# EAGLE board 20150104_QSE_to_FMC_6Layer_R3.1 (EAGLE 7.2.0), part 1 of 6
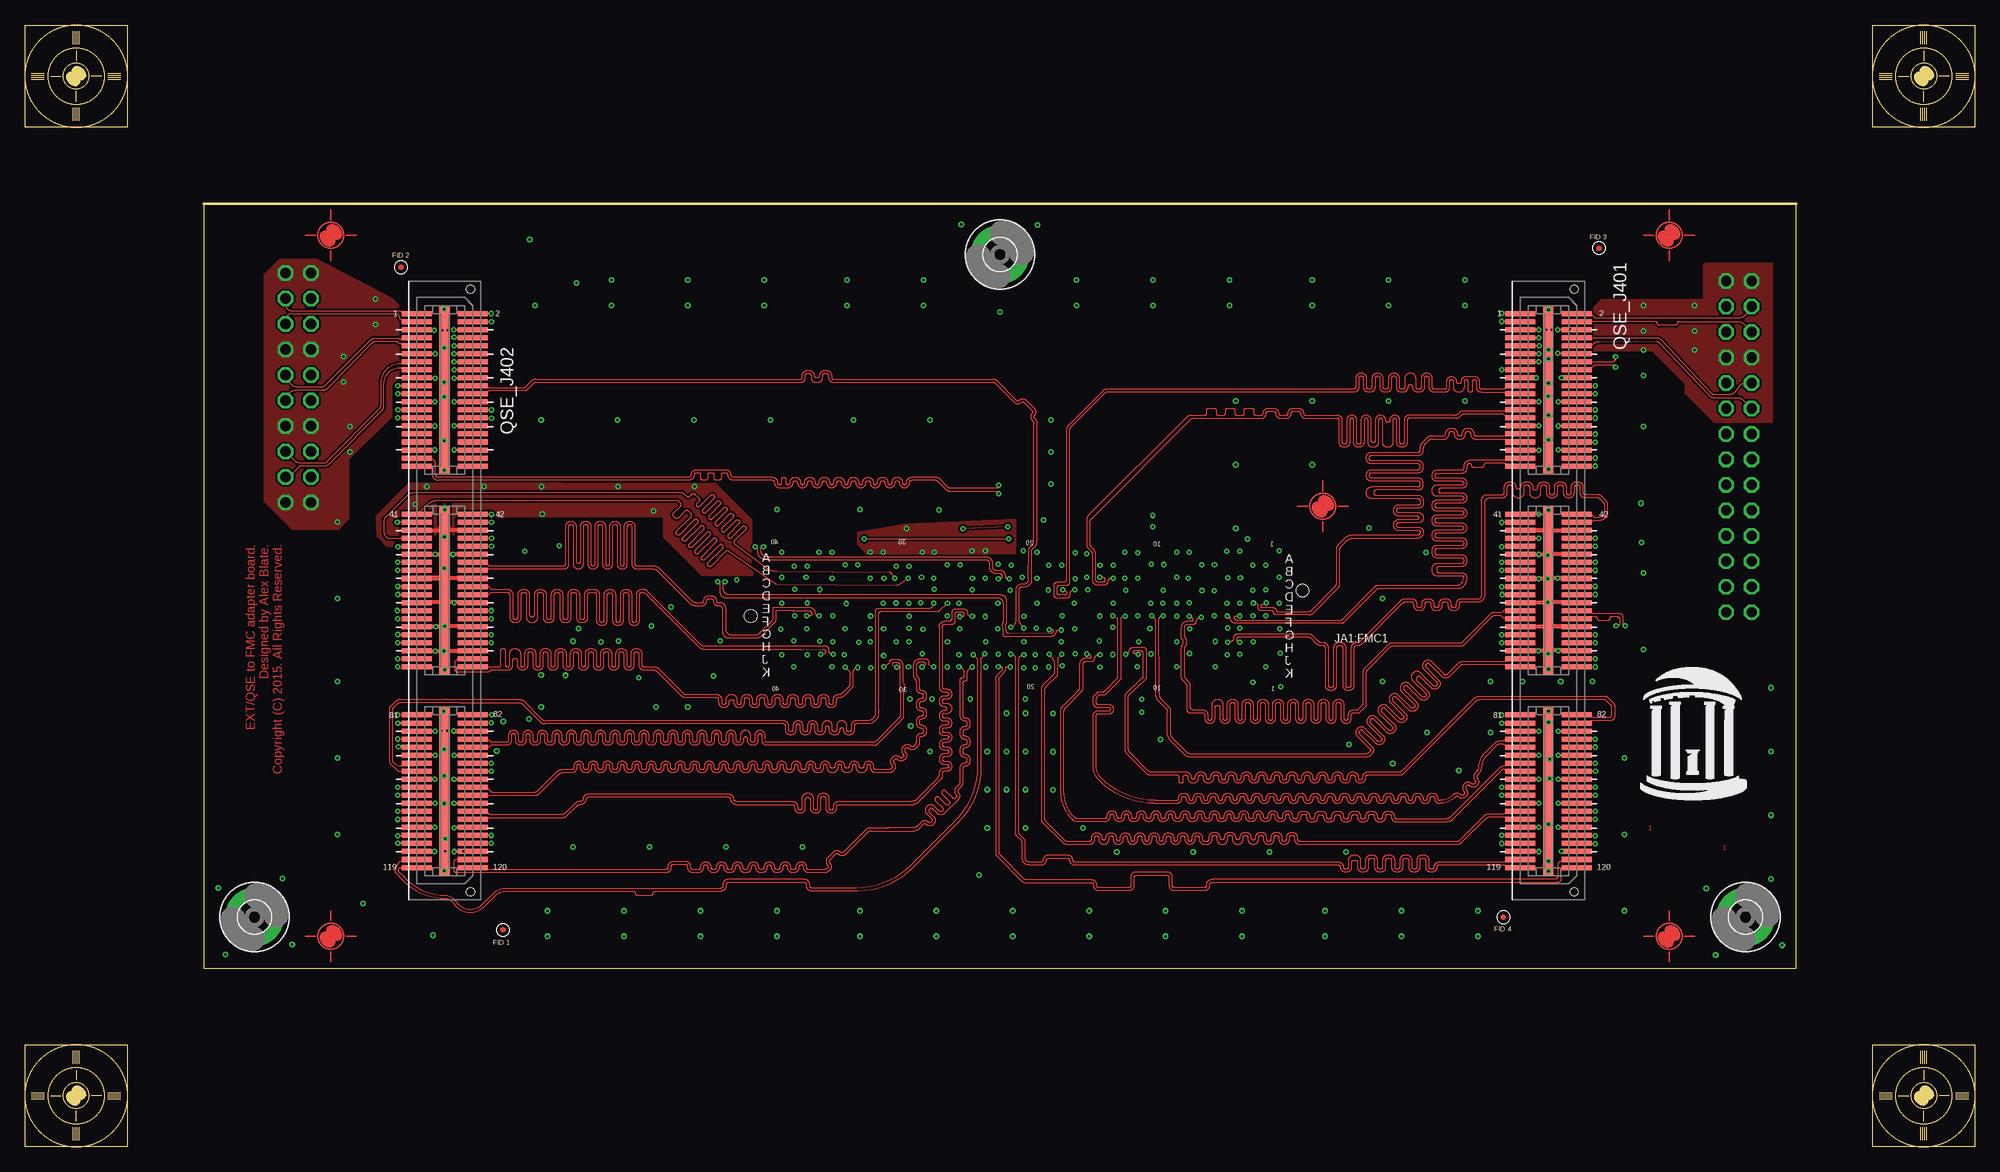
[diagram p6: board, top side]
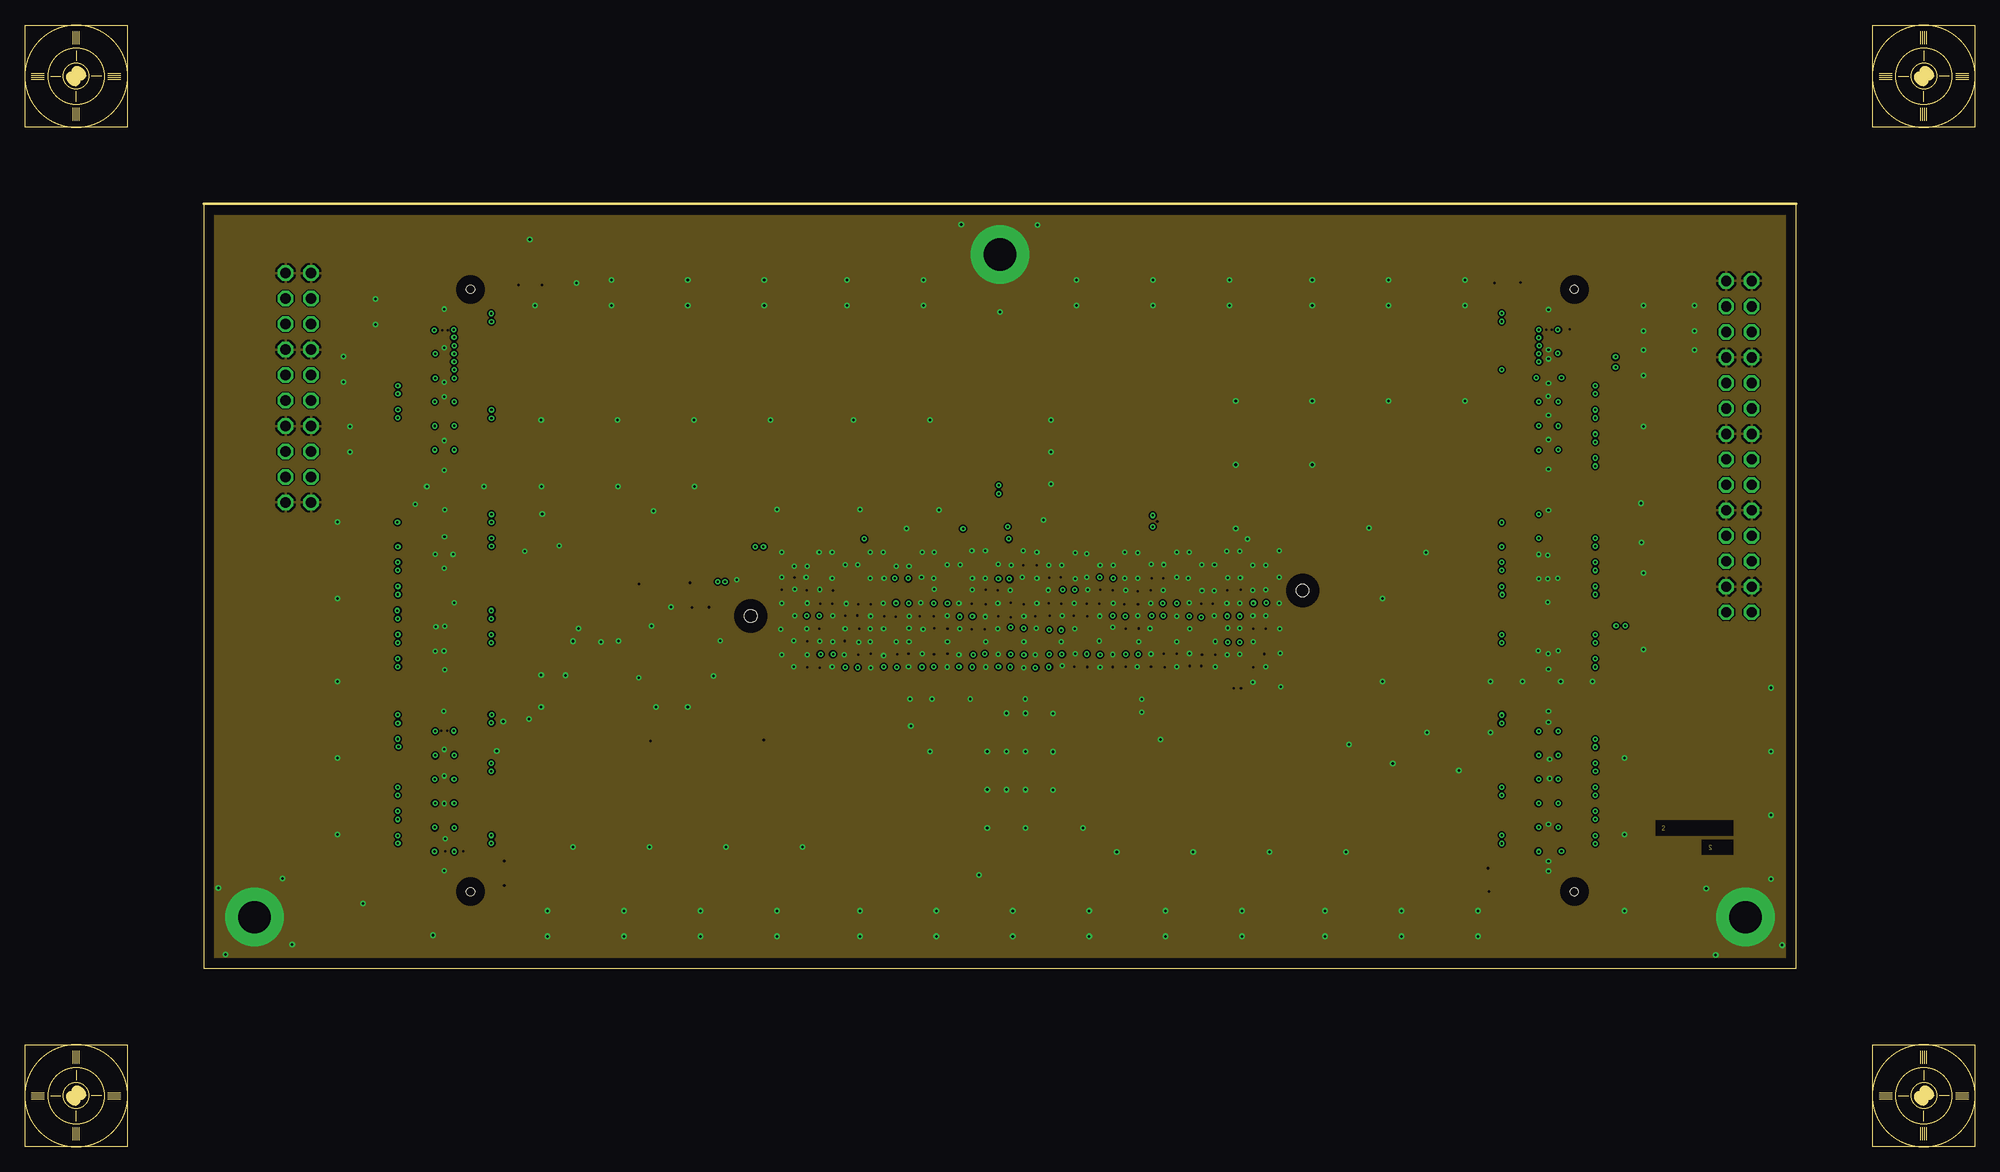
[diagram p7: board, inner layer GND_2]
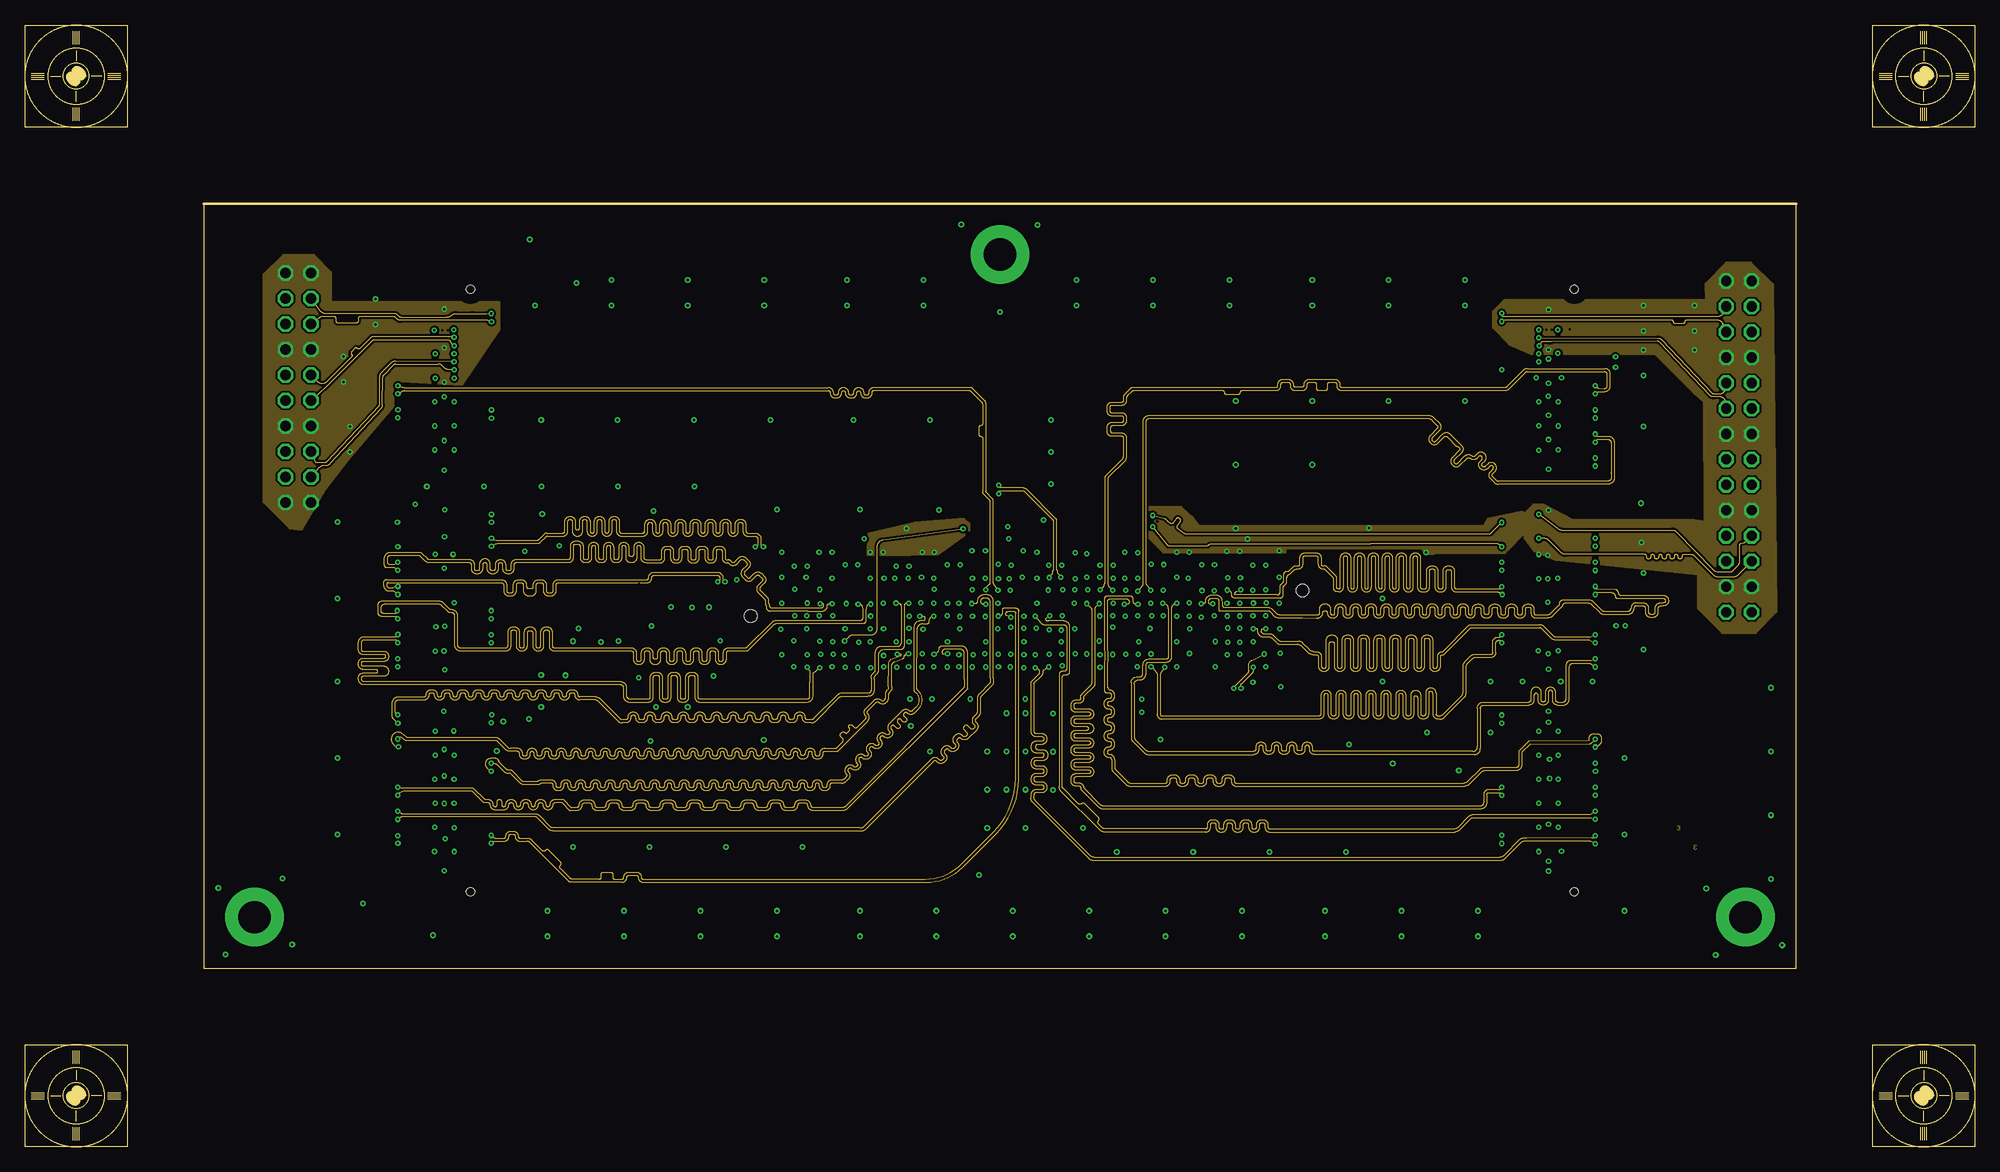
[diagram p8: board, inner layer 3_SIG2]
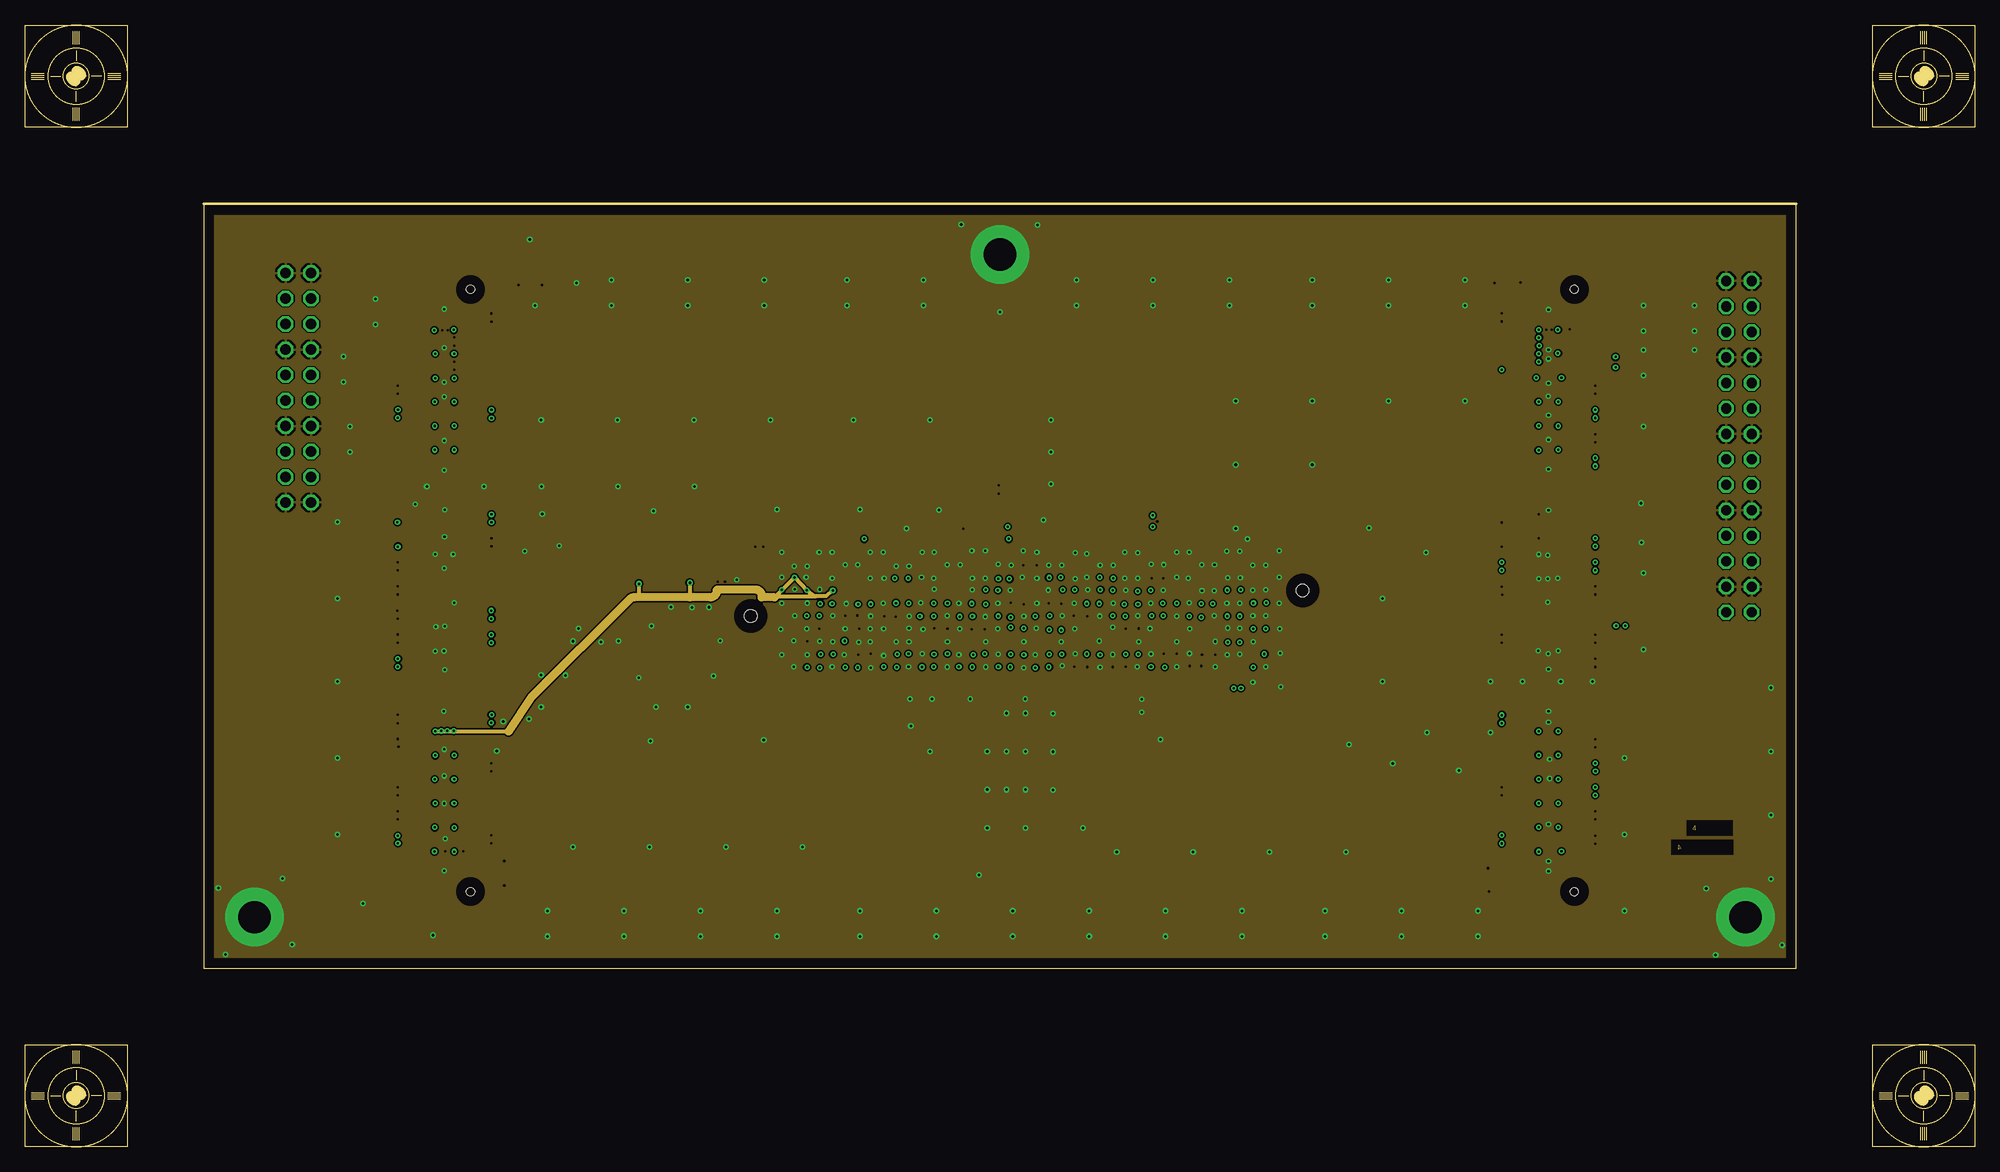
[diagram p9: board, inner layer GND_4]
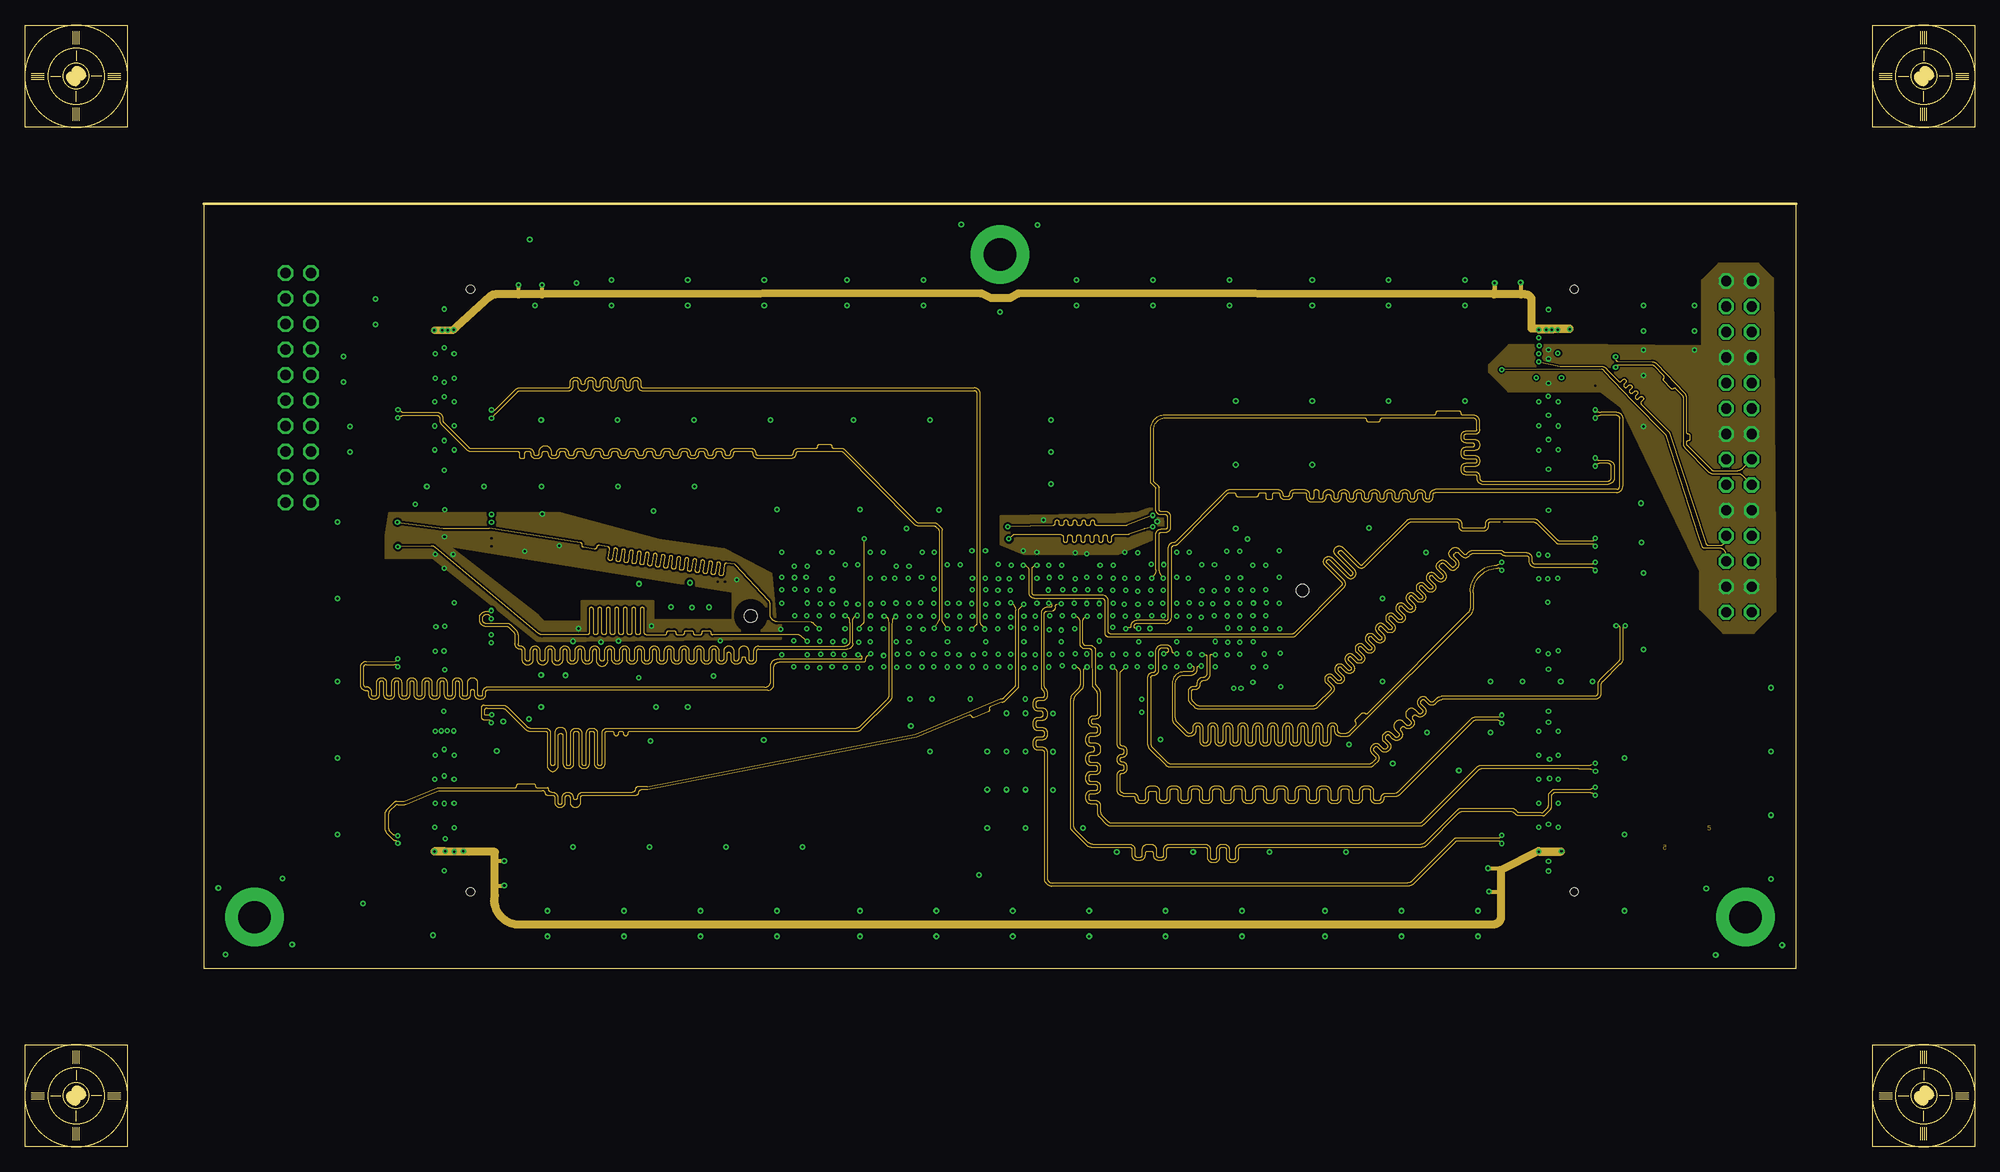
[diagram p10: board, inner layer 5_SIG3]
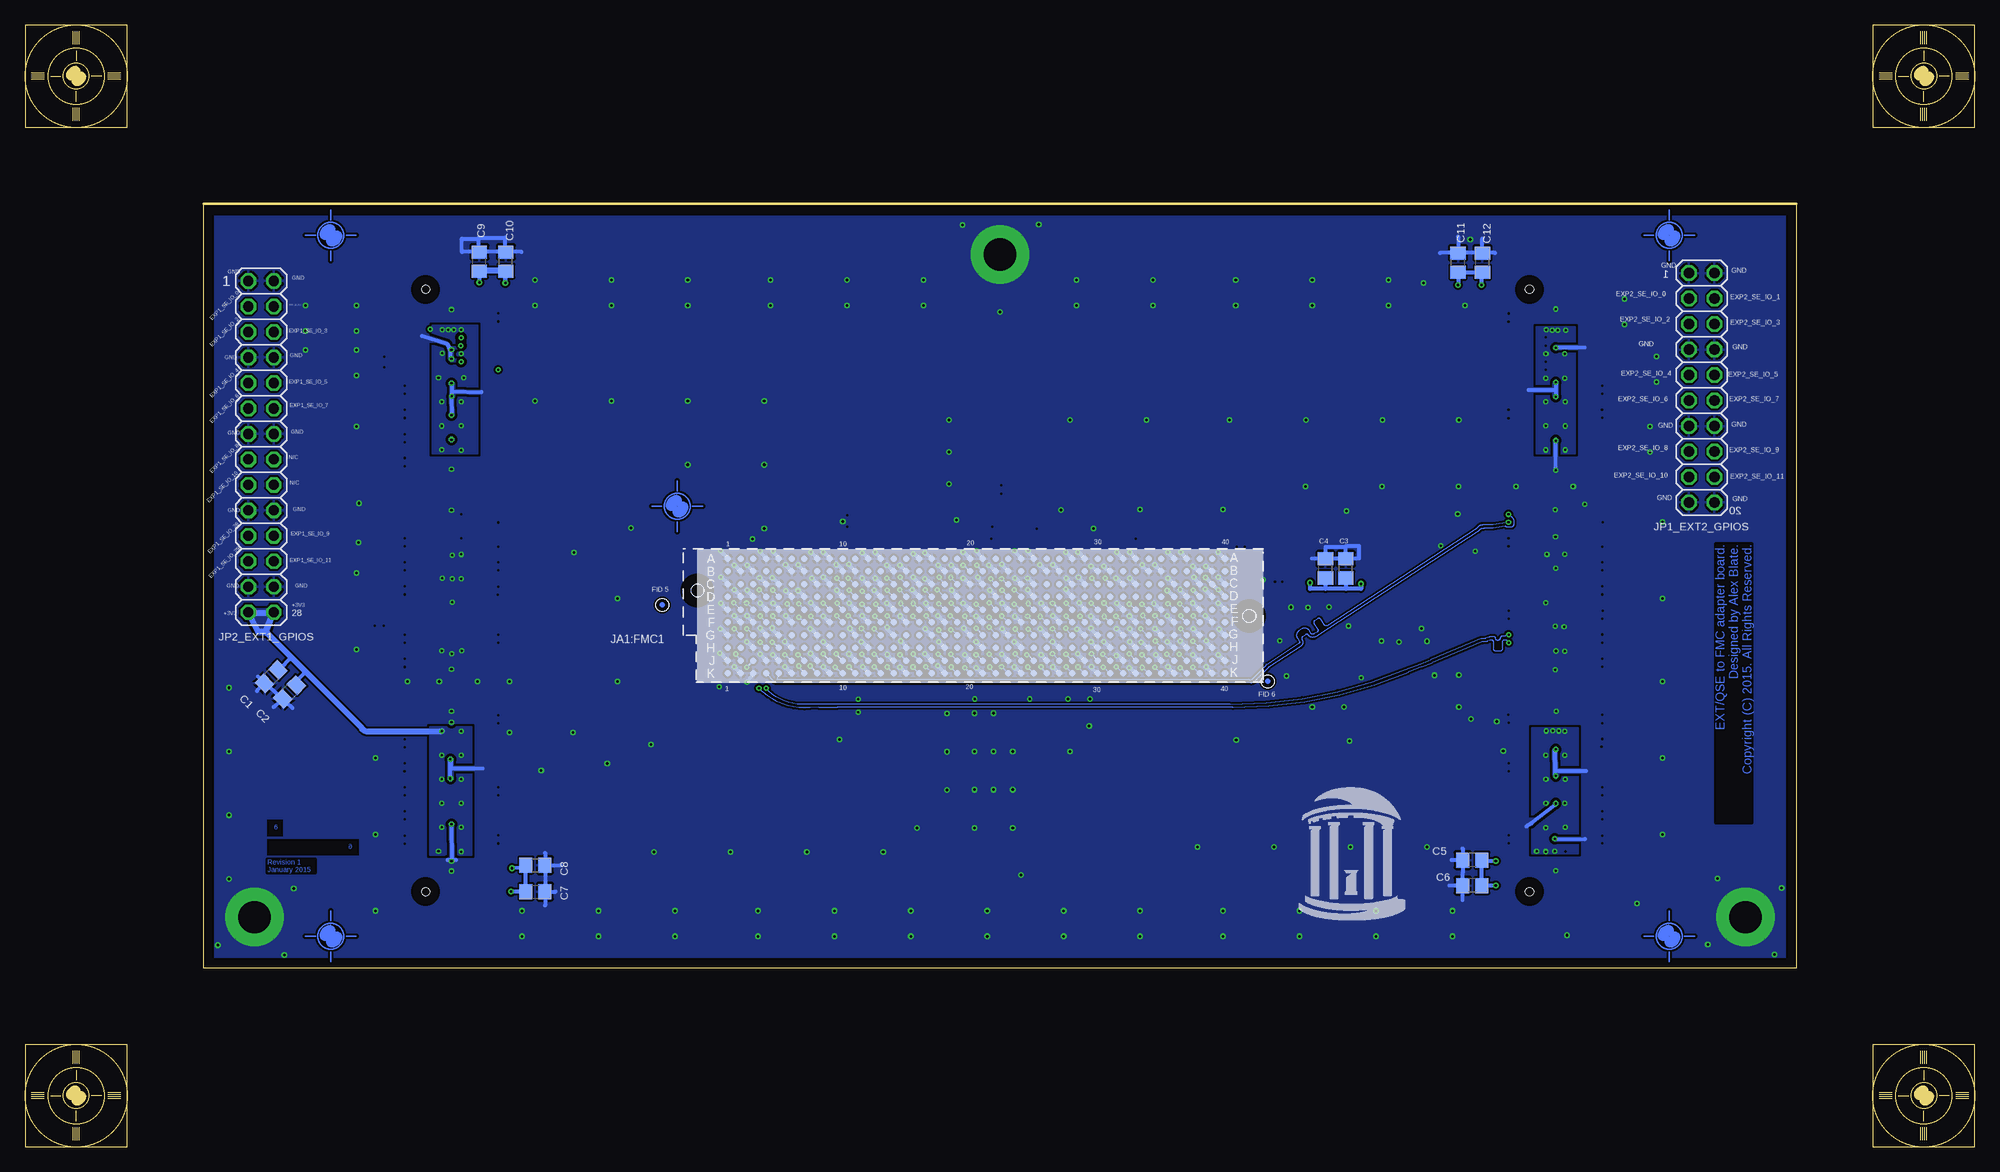
[diagram p11: board, bottom side, seen from below]

Size 194.31 x 111.76 mm. Coordinates in mm from the lower left corner, seen from the top.
Outline: 17.78,17.78 176.53,17.78 176.53,93.98 17.78,93.98 17.78,17.78
Copper layers [[(((1+2*3)+4*5)+16):3]:5]: Top_SIG1 0.035mm / dielectric 0.2mm / GND_2 0.035mm / dielectric 0.4mm / 3_SIG2 0.035mm / dielectric 0.2mm / GND_4 0.035mm / dielectric 0.4mm / 5_SIG3 0.035mm / dielectric 0.2mm / Bottom_SIG4 0.035mm
Design rules "fmc4": minimum track width 4mil, minimum drill 8mil, track to track 6mil, track to pad 6mil, pad to pad 6mil, via to via 6mil, smd to smd 0mil, copper to edge 40mil, drill to drill 8mil, minimum pad ring 10mil, minimum via ring 6mil, stop-mask expansion 3mil, vias tented up to drill 10mil, thermal gap 10mil
Net classes: 0 default: width 0.152 mm; 1 gen_sig: width 0.152 mm, clearance 0.152 mm; 2 diff_sig: width 0.102 mm, drill 0.203 mm, clearance 0.305 mm to class 0, clearance 0.305 mm to class 1, clearance 0.203 mm; 3 GND: width 0.25 mm, drill 0.203 mm, clearance 0.152 mm to class 0, clearance 0.152 mm to class 1, clearance 0.152 mm to class 2; 4 power: width 0.254 mm, clearance 0.152 mm to class 0, clearance 0.152 mm to class 1, clearance 0.152 mm to class 2, clearance 0.152 mm to class 3, clearance 0.152 mm; 5 ref_v: width 0.152 mm, clearance 0.152 mm to class 0, clearance 0.152 mm to class 1, clearance 0.152 mm to class 2, clearance 0.152 mm to class 3, clearance 0.152 mm to class 4, clearance 0.152 mm
tKeepout: area 36.8,87 to 38.1,88.3; area 47,21 to 48.3,22.2; area 156.2,88.9 to 157.5,90.2; area 146.7,22.2 to 148,23.5
bRestrict: area 69.8,45.7 to 71.1,47; area 130.2,53.3 to 131.4,54.6

## Footprints (pad centres in the part's own frame; a part is rotated, then mirrored left to right if it is on the bottom)
C0805 = smd 1.3 x 1.5: 1 -0.95,0; 2 0.95,0
3,2-PAD = drill 3.2 pad 5.842: B3,2 0,0
ASP-134486-01 = smd 0.635 x 0.635: A1 0,0; A2 -1.27,0; A3 -2.54,0; A4 -3.81,0; A5 -5.08,0; A6 -6.35,0; A7 -7.62,0; A8 -8.89,0; A9 -10.16,0; A10 -11.43,0; A11 -12.7,0; A12 -13.97,0; A13 -15.24,0; A14 -16.51,0; A15 -17.78,0; A16 -19.05,0; A17 -20.32,0; A18 -21.59,0; A19 -22.86,0; A20 -24.13,0; A21 -25.4,0; A22 -26.67,0; A23 -27.94,0; A24 -29.21,0; A25 -30.48,0; A26 -31.75,0; A27 -33.02,0; A28 -34.29,0; A29 -35.56,0; A30 -36.83,0; A31 -38.1,0; A32 -39.37,0; A33 -40.64,0; A34 -41.91,0; A35 -43.18,0; A36 -44.45,0; A37 -45.72,0; A38 -46.99,0; A39 -48.26,0; A40 -49.53,0; B1 0,1.27; B2 -1.27,1.27; B3 -2.54,1.27; B4 -3.81,1.27; B5 -5.08,1.27; B6 -6.35,1.27; B7 -7.62,1.27; B8 -8.89,1.27; B9 -10.16,1.27; B10 -11.43,1.27; B11 -12.7,1.27; B12 -13.97,1.27; B13 -15.24,1.27; B14 -16.51,1.27; B15 -17.78,1.27; B16 -19.05,1.27; B17 -20.32,1.27; B18 -21.59,1.27; B19 -22.86,1.27; B20 -24.13,1.27; B21 -25.4,1.27; B22 -26.67,1.27; B23 -27.94,1.27; B24 -29.21,1.27; B25 -30.48,1.27; B26 -31.75,1.27; B27 -33.02,1.27; B28 -34.29,1.27; B29 -35.56,1.27; B30 -36.83,1.27; B31 -38.1,1.27; B32 -39.37,1.27; B33 -40.64,1.27; B34 -41.91,1.27; B35 -43.18,1.27; B36 -44.45,1.27; B37 -45.72,1.27; B38 -46.99,1.27; B39 -48.26,1.27; B40 -49.53,1.27; C1 0,2.54; C2 -1.27,2.54; C3 -2.54,2.54; C4 -3.81,2.54; C5 -5.08,2.54; C6 -6.35,2.54; C7 -7.62,2.54; C8 -8.89,2.54; C9 -10.16,2.54; C10 -11.43,2.54; C11 -12.7,2.54; C12 -13.97,2.54; C13 -15.24,2.54; C14 -16.51,2.54; C15 -17.78,2.54; C16 -19.05,2.54; C17 -20.32,2.54; C18 -21.59,2.54; C19 -22.86,2.54; C20 -24.13,2.54; C21 -25.4,2.54; C22 -26.67,2.54; C23 -27.94,2.54; C24 -29.21,2.54; C25 -30.48,2.54; C26 -31.75,2.54; C27 -33.02,2.54; C28 -34.29,2.54; C29 -35.56,2.54; C30 -36.83,2.54; C31 -38.1,2.54; C32 -39.37,2.54; C33 -40.64,2.54; C34 -41.91,2.54; C35 -43.18,2.54; C36 -44.45,2.54; C37 -45.72,2.54; C38 -46.99,2.54; C39 -48.26,2.54; C40 -49.53,2.54; D1 0,3.81; D2 -1.27,3.81; D3 -2.54,3.81; D4 -3.81,3.81; D5 -5.08,3.81; D6 -6.35,3.81; D7 -7.62,3.81; D8 -8.89,3.81; D9 -10.16,3.81; D10 -11.43,3.81; D11 -12.7,3.81; D12 -13.97,3.81; D13 -15.24,3.81; D14 -16.51,3.81; D15 -17.78,3.81; D16 -19.05,3.81; D17 -20.32,3.81; D18 -21.59,3.81; D19 -22.86,3.81; D20 -24.13,3.81; D21 -25.4,3.81; D22 -26.67,3.81; D23 -27.94,3.81; D24 -29.21,3.81; D25 -30.48,3.81; D26 -31.75,3.81; D27 -33.02,3.81; D28 -34.29,3.81; D29 -35.56,3.81; D30 -36.83,3.81; D31 -38.1,3.81; D32 -39.37,3.81; D33 -40.64,3.81; D34 -41.91,3.81; D35 -43.18,3.81; D36 -44.45,3.81; D37 -45.72,3.81; D38 -46.99,3.81; D39 -48.26,3.81; D40 -49.53,3.81; E1 0,5.08; E2 -1.27,5.08; E3 -2.54,5.08; E4 -3.81,5.08; E5 -5.08,5.08; E6 -6.35,5.08; E7 -7.62,5.08; E8 -8.89,5.08; E9 -10.16,5.08; E10 -11.43,5.08; E11 -12.7,5.08; E12 -13.97,5.08; E13 -15.24,5.08; E14 -16.51,5.08; E15 -17.78,5.08; E16 -19.05,5.08; E17 -20.32,5.08; E18 -21.59,5.08; E19 -22.86,5.08; E20 -24.13,5.08; E21 -25.4,5.08; E22 -26.67,5.08; E23 -27.94,5.08; E24 -29.21,5.08; E25 -30.48,5.08; E26 -31.75,5.08; E27 -33.02,5.08; E28 -34.29,5.08; E29 -35.56,5.08; E30 -36.83,5.08; E31 -38.1,5.08; E32 -39.37,5.08; E33 -40.64,5.08; E34 -41.91,5.08; E35 -43.18,5.08; E36 -44.45,5.08; E37 -45.72,5.08; E38 -46.99,5.08; E39 -48.26,5.08; E40 -49.53,5.08; F1 0,6.35; F2 -1.27,6.35; F3 -2.54,6.35; F4 -3.81,6.35; F5 -5.08,6.35; F6 -6.35,6.35; F7 -7.62,6.35; F8 -8.89,6.35; F9 -10.16,6.35; F10 -11.43,6.35; F11 -12.7,6.35; F12 -13.97,6.35; F13 -15.24,6.35; F14 -16.51,6.35; F15 -17.78,6.35; F16 -19.05,6.35; F17 -20.32,6.35; F18 -21.59,6.35; F19 -22.86,6.35; F20 -24.13,6.35; F21 -25.4,6.35; F22 -26.67,6.35; F23 -27.94,6.35; F24 -29.21,6.35; F25 -30.48,6.35; F26 -31.75,6.35; F27 -33.02,6.35; F28 -34.29,6.35; F29 -35.56,6.35; F30 -36.83,6.35; F31 -38.1,6.35; F32 -39.37,6.35; F33 -40.64,6.35; F34 -41.91,6.35; F35 -43.18,6.35; F36 -44.45,6.35; F37 -45.72,6.35; F38 -46.99,6.35; F39 -48.26,6.35; F40 -49.53,6.35; G1 0,7.62; G2 -1.27,7.62; G3 -2.54,7.62; G4 -3.81,7.62; G5 -5.08,7.62; G6 -6.35,7.62; G7 -7.62,7.62; G8 -8.89,7.62; G9 -10.16,7.62; G10 -11.43,7.62; G11 -12.7,7.62; G12 -13.97,7.62; G13 -15.24,7.62; G14 -16.51,7.62; G15 -17.78,7.62; G16 -19.05,7.62; G17 -20.32,7.62; G18 -21.59,7.62; G19 -22.86,7.62; G20 -24.13,7.62; G21 -25.4,7.62; G22 -26.67,7.62; G23 -27.94,7.62; G24 -29.21,7.62; G25 -30.48,7.62; G26 -31.75,7.62; G27 -33.02,7.62; G28 -34.29,7.62; G29 -35.56,7.62; G30 -36.83,7.62; G31 -38.1,7.62; G32 -39.37,7.62; G33 -40.64,7.62; G34 -41.91,7.62; G35 -43.18,7.62; G36 -44.45,7.62; G37 -45.72,7.62; G38 -46.99,7.62; G39 -48.26,7.62; G40 -49.53,7.62; H1 0,8.89; H2 -1.27,8.89; H3 -2.54,8.89; H4 -3.81,8.89; H5 -5.08,8.89; H6 -6.35,8.89; H7 -7.62,8.89; H8 -8.89,8.89; H9 -10.16,8.89; H10 -11.43,8.89; H11 -12.7,8.89; H12 -13.97,8.89; H13 -15.24,8.89; H14 -16.51,8.89; H15 -17.78,8.89; H16 -19.05,8.89; H17 -20.32,8.89; H18 -21.59,8.89; H19 -22.86,8.89; H20 -24.13,8.89; H21 -25.4,8.89; H22 -26.67,8.89; H23 -27.94,8.89; H24 -29.21,8.89; H25 -30.48,8.89; H26 -31.75,8.89; H27 -33.02,8.89; H28 -34.29,8.89; H29 -35.56,8.89; H30 -36.83,8.89; H31 -38.1,8.89; H32 -39.37,8.89; H33 -40.64,8.89; H34 -41.91,8.89; H35 -43.18,8.89; H36 -44.45,8.89; H37 -45.72,8.89; H38 -46.99,8.89; H39 -48.26,8.89; H40 -49.53,8.89; J1 0,10.16; J2 -1.27,10.16; J3 -2.54,10.16; J4 -3.81,10.16; J5 -5.08,10.16; J6 -6.35,10.16; J7 -7.62,10.16; J8 -8.89,10.16; J9 -10.16,10.16; J10 -11.43,10.16; J11 -12.7,10.16; J12 -13.97,10.16; J13 -15.24,10.16; J14 -16.51,10.16; J15 -17.78,10.16; J16 -19.05,10.16; J17 -20.32,10.16; J18 -21.59,10.16; J19 -22.86,10.16; J20 -24.13,10.16; J21 -25.4,10.16; J22 -26.67,10.16; J23 -27.94,10.16; J24 -29.21,10.16; J25 -30.48,10.16; J26 -31.75,10.16; J27 -33.02,10.16; J28 -34.29,10.16; J29 -35.56,10.16; J30 -36.83,10.16; J31 -38.1,10.16; J32 -39.37,10.16; J33 -40.64,10.16; J34 -41.91,10.16; J35 -43.18,10.16; J36 -44.45,10.16; J37 -45.72,10.16; J38 -46.99,10.16; J39 -48.26,10.16; J40 -49.53,10.16; K1 0,11.43; K2 -1.27,11.43; K3 -2.54,11.43; K4 -3.81,11.43; K5 -5.08,11.43; K6 -6.35,11.43; K7 -7.62,11.43; K8 -8.89,11.43; K9 -10.16,11.43; K10 -11.43,11.43; K11 -12.7,11.43; K12 -13.97,11.43; K13 -15.24,11.43; K14 -16.51,11.43; K15 -17.78,11.43; K16 -19.05,11.43; K17 -20.32,11.43; K18 -21.59,11.43; K19 -22.86,11.43; K20 -24.13,11.43; K21 -25.4,11.43; K22 -26.67,11.43; K23 -27.94,11.43; K24 -29.21,11.43; K25 -30.48,11.43; K26 -31.75,11.43; K27 -33.02,11.43; K28 -34.29,11.43; K29 -35.56,11.43; K30 -36.83,11.43; K31 -38.1,11.43; K32 -39.37,11.43; K33 -40.64,11.43; K34 -41.91,11.43; K35 -43.18,11.43; K36 -44.45,11.43; K37 -45.72,11.43; K38 -46.99,11.43; K39 -48.26,11.43; K40 -49.53,11.43 | hole 1.27: -51.956,5.715; 3.048,3.175
2X10 = drill 1.016 octagon: 1 -11.43,-1.27; 2 -11.43,1.27; 3 -8.89,-1.27; 4 -8.89,1.27; 5 -6.35,-1.27; 6 -6.35,1.27; 7 -3.81,-1.27; 8 -3.81,1.27; 9 -1.27,-1.27; 10 -1.27,1.27; 11 1.27,-1.27; 12 1.27,1.27; 13 3.81,-1.27; 14 3.81,1.27; 15 6.35,-1.27; 16 6.35,1.27; 17 8.89,-1.27; 18 8.89,1.27; 19 11.43,-1.27; 20 11.43,1.27
2X14 = drill 1.016 octagon: 1 -16.51,-1.27; 2 -16.51,1.27; 3 -13.97,-1.27; 4 -13.97,1.27; 5 -11.43,-1.27; 6 -11.43,1.27; 7 -8.89,-1.27; 8 -8.89,1.27; 9 -6.35,-1.27; 10 -6.35,1.27; 11 -3.81,-1.27; 12 -3.81,1.27; 13 -1.27,-1.27; 14 -1.27,1.27; 15 1.27,-1.27; 16 1.27,1.27; 17 3.81,-1.27; 18 3.81,1.27; 19 6.35,-1.27; 20 6.35,1.27; 21 8.89,-1.27; 22 8.89,1.27; 23 11.43,-1.27; 24 11.43,1.27; 25 13.97,-1.27; 26 13.97,1.27; 27 16.51,-1.27; 28 16.51,1.27
QSE-060-01 = smd 0.5 x 3: 1 0.019,0; 2 0.019,5.601; 3 0.819,0; 4 0.819,5.601; 5 1.619,0; 6 1.619,5.601; 7 2.419,0; 8 2.419,5.601; 9 3.22,0; 10 3.22,5.601; 11 4.02,0; 12 4.02,5.601; 13 4.82,0; 14 4.82,5.601; 15 5.62,0; 16 5.62,5.601; 17 6.42,0; 18 6.42,5.601; 19 7.22,0; 20 7.22,5.601; 21 8.02,0; 22 8.02,5.601; 23 8.82,0; 24 8.82,5.601; 25 9.62,0; 26 9.62,5.601; 27 10.42,0; 28 10.42,5.601; 29 11.22,0; 30 11.22,5.601; 31 12.021,0; 32 12.021,5.601; 33 12.821,0; 34 12.821,5.601; 35 13.621,0; 36 13.621,5.601; 37 14.421,0; 38 14.421,5.601; 39 15.221,0; 40 15.221,5.601; 41 20.022,0; 42 20.022,5.601; 43 20.822,0; 44 20.822,5.601; 45 21.622,0; 46 21.622,5.601; 47 22.422,0; 48 22.422,5.601; 49 23.222,0; 50 23.222,5.601; 51 24.022,0; 52 24.022,5.601; 53 24.822,0; 54 24.822,5.601; 55 25.622,0; 56 25.622,5.601; 57 26.422,0; 58 26.422,5.601; 59 27.223,0; 60 27.223,5.601; 61 28.023,0; 62 28.023,5.601; 63 28.823,0; 64 28.823,5.601; 65 29.623,0; 66 29.623,5.601; 67 30.423,0; 68 30.423,5.601; 69 31.223,0; 70 31.223,5.601; 71 32.023,0; 72 32.023,5.601; 73 32.823,0; 74 32.823,5.601; 75 33.623,0; 76 33.623,5.601; 77 34.423,0; 78 34.423,5.601; 79 35.224,0; 80 35.224,5.601; 81 40.024,0; 82 40.024,5.601; 83 40.824,0; 84 40.824,5.601; 85 41.624,0; 86 41.624,5.601; 87 42.424,0; 88 42.424,5.601; 89 43.224,0; 90 43.224,5.601; 91 44.025,0; 92 44.025,5.601; 93 44.825,0; 94 44.825,5.601; 95 45.625,0; 96 45.625,5.601; 97 46.425,0; 98 46.425,5.601; 99 47.225,0; 100 47.225,5.601; 101 48.025,0; 102 48.025,5.601; 103 48.825,0; 104 48.825,5.601; 105 49.625,0; 106 49.625,5.601; 107 50.425,0; 108 50.425,5.601; 109 51.225,0; 110 51.225,5.601; 111 52.026,0; 112 52.026,5.601; 113 52.826,0; 114 52.826,5.601; 115 53.626,0; 116 53.626,5.601; 117 54.426,0; 118 54.426,5.601; 119 55.226,0; 120 55.226,5.601 | smd 4.21 x 1.016: GND1 1.315,2.781; GND2 5.505,2.781; GND3 9.697,2.781; GND4 13.887,2.781; GND5 21.317,2.781; GND6 25.508,2.781; GND7 29.699,2.781; GND8 33.89,2.781; GND9 41.319,2.781; GND10 45.511,2.781; GND11 49.702,2.781; GND12 53.892,2.781 | hole 0.8: -2.381,5.372; 57.626,5.372

## Placement (x,y rotation side)
C1  10u  [C0805]  169.77,46.84 225 bottom
C2  10n  [C0805]  167.94,45.31 225 bottom
C3  10u  [C0805]  62.69,57.61 90 bottom
C4  10n  [C0805]  64.72,57.61 90 bottom
C5  10u  [C0805]  50.09,28.55 180 bottom
C6  10n  [C0805]  50.09,26.01 180 bottom
C7  10u  [C0805]  143.46,25.4 0 bottom
C8  10n  [C0805]  143.46,28.04 0 bottom
C9  10u  [C0805]  149.05,88.19 90 bottom
C10  10n  [C0805]  146.41,88.19 90 bottom
C11  10u  [C0805]  51.51,88.09 90 bottom
C12  10n  [C0805]  49.07,88.09 90 bottom
DRILEGEND  [DRILEGEND]  not placed on the board
H1  MOUNT-PAD-ROUND3.2  [3,2-PAD]  22.86,22.86 0 top
H2  MOUNT-PAD-ROUND3.2  [3,2-PAD]  97.16,88.9 0 top
H3  MOUNT-PAD-ROUND3.2  [3,2-PAD]  171.45,22.86 0 top
JA1:FMC1  >NAME  [ASP-134486-01]  124.26,58.59 180 bottom
JP1_EXT2_GPIOS  [2X10]  27.23,75.62 270 bottom
JP2_EXT1_GPIOS  [2X14]  170.79,69.75 270 bottom
QSE_J401  [QSE-060-01]  149.02,83.03 270 top
QSE_J402  [QSE-060-01]  39.02,83.03 270 top
U$2  [PASS-ROUND]  129.34,63.8 0 top
U$3  [PASS-ROUND]  163.83,20.96 0 top
U$4  [PASS-ROUND]  30.48,20.96 0 top
U$5  [PASS-ROUND]  30.48,90.81 0 top
U$6  [PASS-ROUND]  163.83,90.81 0 top
U$8  [ALIGNMENT]  5.08,5.08 0 top
U$9  [ALIGNMENT]  5.08,106.68 0 top
U$10  [ALIGNMENT]  189.23,106.68 0 top
U$11  [ALIGNMENT]  189.23,5.08 0 top

## Tracks (layer width: path | path; a pad name or v marks a point on that pad's centre or on a via)
+2V5  (via drill 0.2 pad 0.25, 0.2 pad 0.51, 0.2 pad 0.51 layers 5-16, 0.25 pad 0.25 layers 5-16)
  Top_SIG1 0.254: QSE_J402.5 40.63,81.41 v40.79,81.36 | QSE_J402.11 40.6,79.01 v40.88,79.02 | QSE_J402.12 43.12,79.01 v42.75,79.02 | QSE_J402.6 43.46,81.41 v42.72,81.38 | QSE_J401.5 150.71,81.4 v150.85,81.41 | QSE_J401.6 153.12,81.41 v152.76,81.41 | QSE_J401.11 150.48,79.01 v150.82,79.01 | QSE_J401.17 v150.59,76.61 v150.6,76.61 | QSE_J401.18 153.18,76.61 v153.11,76.61 | QSE_J401.24 153.16,74.21 v152.78,74.22 | QSE_J401.23 150.55,74.21 v150.82,74.22 | QSE_J401.12 v152.76,79.05 | QSE_J401.30 v152.77,71.81 | QSE_J401.29 v150.82,71.83 | QSE_J401.35 v150.82,69.41 | QSE_J401.36 v152.78,69.46 | QSE_J402.18 | QSE_J402.18 44.68,76.61 | QSE_J402.18 v42.76,76.58 | v40.86,76.58 40.56,76.61 QSE_J402.17 | v40.82,74.22 40.44,74.21 QSE_J402.23 | v40.83,71.81 40.56,71.81 QSE_J402.29 | v40.83,69.42 40.53,69.41 QSE_J402.35 | v42.77,69.42 43.12,69.41 QSE_J402.36 | v42.77,71.82 43.09,71.81 QSE_J402.30 | v42.77,74.21 42.88,74.21 QSE_J402.24
  5_SIG3 0.406: v51.51,85.85 51.51,84.92 | 49.16,84.92 v49.17,85.85 | v149.05,86.11 149.06,84.91 | 146.39,84.92 v146.46,86.06 146.46,84.78
  5_SIG3 0.762: 40.82,81.36 42.52,81.36 arc45 42.74,81.45 42.98,81.69 46.38,84.73 | 42.95,81.66 42.95,81.64 v42.72,81.38
  5_SIG3 0.813: v150.85,81.41 153.83,81.52 arc-45 153.92,81.48 150.14,81.51 150.14,84.3 arc90 149.53,84.91 149.06,84.91 146.39,84.92 99.01,85.01 98.17,84.56 96.27,84.56 95.28,85.01 51.51,84.92 49.16,84.92 46.81,84.91 arc46 46.38,84.73 42.95,81.64
  Bottom_SIG4 0.406: C11.1 C12.1 49.18,87.13 | 49.18,87.13 51.51,87.07 v51.51,85.85 | 49.18,87.13 v49.17,85.85 | C10.1 C9.1 v149.05,86.11 | v146.46,86.06 146.51,87.07 146.41,87.38 149.05,87.38 146.41,87.27 v146.46,86.06
  other vias: 41.55,81.36 42.14,81.36 152.16,81.39 151.59,81.41 153.92,81.46
  pour Bottom_SIG4 (isolate 0.305): 39.88,81.66 43.69,81.66 43.69,69.09 39.88,69.09
  pour Bottom_SIG4 (isolate 0.305): 149.22,81.79 153.67,81.79 153.67,69.09 149.22,69.09
+3V3  (via drill 0.2 pad 0.51, 0.2 pad 0.51 layers 4-16, 0.2 pad 0.51 layers 5-16, 0.25 layers 4-16, 0.25 pad 0.25 layers 1-5, 0.25 pad 0.25 layers 4-16, 0.25 pad 0.25 layers 5-16, 0.25 pad 0.51 layers 4-16)
  Top_SIG1 0.254: QSE_J401.86 153.07,41.41 v152.77,41.4 | QSE_J401.92 153.16,39.01 v152.77,39.01 | QSE_J401.98 153.12,36.61 v152.77,36.6 | QSE_J401.104 153.07,34.21 v152.78,34.21 | QSE_J401.110 153.12,31.81 v152.78,31.8 | QSE_J401.116 153.14,29.41 v153.11,29.44 | QSE_J401.115 150.49,29.41 v150.82,29.4 | QSE_J401.109 150.59,31.81 v150.82,31.81 | QSE_J401.103 150.56,34.21 v150.82,34.21 | QSE_J401.97 150.59,36.61 v150.82,36.6 | QSE_J401.91 150.56,39.01 v150.82,39.01 | QSE_J401.85 150.51,41.41 v150.82,41.4 | 43,41.41 v42.74,41.42 | QSE_J402.85 40.64,41.41 v40.87,41.4 | QSE_J402.91 40.87,39.02 v40.87,38.98 | QSE_J402.92 43.08,39.01 v42.76,39.01 | QSE_J402.97 40.56,36.61 v40.83,36.59 | QSE_J402.98 43.08,36.61 v42.75,36.59 | QSE_J402.103 40.49,34.21 v40.86,34.21 | QSE_J402.104 43.08,34.21 v42.75,34.23 | QSE_J402.110 43.08,31.81 v42.77,31.79 | QSE_J402.109 40.49,31.81 v40.82,31.8 | QSE_J402.115 v40.81,29.39 | QSE_J402.116 43.08,29.41 v42.76,29.4
  Top_SIG1 0.406: QSE_J402.86 43,41.41 | QSE_J402.86 42.98,41.4 | 42.98,41.4 44.67,41.4 45.12,41.37 45.49,41.43 QSE_J402.86 | 42.98,41.4 v42.74,41.42
  GND_4 0.254: 79.76,54.89 79.81,54.89
  GND_4 0.406: 79.76,54.89 78.61,54.89 v77.9,55.42 77.88,55.45 v76.68,56.72 75.43,55.47 | 79.81,54.89 v80.49,55.42 | v75.42,55.47 75.43,55.47 | 75.43,55.47 74.73,54.76 | 74.73,54.76 74.7,54.74 | 48.16,41.35 40.89,41.35 | v66.24,56.19 66.24,54.74 | v61.16,56.08 61.16,54.97 | 40.89,41.35 v40.87,41.4 | 74.73,54.76 74.73,54.86 78.87,54.86 | 78.94,54.86 78.87,54.86 | 78.87,54.86 78.59,54.89 77.95,55.37 | 40.89,41.35 40.89,41.4 v41.47,41.42
  GND_4 0.813: 74.7,54.74 73.41,54.74 73.41,54.89 arc90 72.8,55.5 69.06,55.5 arc90 68.91,55.35 arc-90 68.3,54.74 66.24,54.74 60.7,54.74 arc45 60.27,54.56 50.39,44.7 48.16,41.35
  5_SIG3 0.254: 42.8,29.39 42.77,29.39 v42.76,29.4
  5_SIG3 0.406: v47.75,26.01 46.74,26.01 46.74,28.26 arc-45 46.81,28.45 | v145.9,25.4 147.03,25.4 arc45 147.06,25.41 | v145.8,27.74 146.93,27.74 | v40.81,29.39 v41.87,29.42 | v47.75,28.45 46.81,28.45 | 46.81,28.45 46.74,28.45 | v41.86,29.41 42.8,29.39
  5_SIG3 0.813: v150.82,29.4 153.06,29.39 150.8,29.44 150.77,29.41 147.07,27.56 147.06,25.41 147.07,22.99 arc-90 146.51,22.17 48.74,22.17 arc-90 46.81,25.02 46.81,28.45 46.81,29.36 42.8,29.39 v41.87,29.42 40.79,29.41 44.2,29.39
  Bottom_SIG4 0.254: QSE_J401.86 153.19,41.41 153.11,41.33 153.03,41.33
  Bottom_SIG4 0.406: JA1:FMC1.D40 v75.42,55.47 JA1:FMC1.C39 v76.67,56.72 v76.68,56.72 | JA1:FMC1.D36 80.45,55.42 v80.49,55.42 | QSE_J401.86 v152.77,41.4 | C1.1 arc-45 168.93,47.58 167.77,48.74 | C2.1 arc45 167.51,46.16 166.34,47.32 | 48.58,28.45 49.17,28.45 49.17,26.01 C6.1 v47.75,26.01 | v47.75,28.45 48.58,28.45 | 48.58,28.45 arc45 49.11,28.52 C5.1 | v145.9,25.4 C7.1 144.41,27.8 | 144.41,27.8 C8.1 | 144.41,27.8 v145.8,27.74 | v77.9,55.42 JA1:FMC1.D38 | 61.14,56.11 61.16,56.06 v61.16,56.08 61.16,55.58 62.69,55.58 | 62.69,55.58 64.72,55.58 | 64.72,55.58 66.24,55.58 v66.24,56.19 | 64.72,55.58 C4.1 64.72,56.69 | 62.69,55.58 C3.1 62.69,56.69
  Bottom_SIG4 0.61: 170.33,51.31 167.77,48.74 166.34,47.32 160.81,41.77 arc-45 160.36,41.4 v152.77,41.4 | 170.33,51.31 169.56,53.15 | 169.56,53.15 JP2_EXT1_GPIOS.28 | 170.33,51.31 171.09,51.31 JP2_EXT1_GPIOS.27 | 169.56,53.15 172.09,53.14
  other vias: 42.06,41.43 43.69,29.41
  pour Bottom_SIG4 (isolate 0.305): 149.86,41.78 153.92,41.78 153.92,29.08 149.86,29.08
  pour Bottom_SIG4 (isolate 0.305): 39.6,41.71 44.09,41.71 44.09,29.21 39.6,29.21
  pour Bottom_SIG4 (no thermals): 169.57,53.34 172.21,53.34 171.09,51.21 170.28,51.21
CLK0_M2C_N  (via drill 0.2 pad 0.51)
  Top_SIG1 0.102: v119.84,50.24 arc-90 119.89,50.29 120.04,50.29 arc90 120.45,50.7 arc-90 120.87,51.12 127.86,51.12 arc-45 128.3,50.94 128.81,50.42 arc45 129.25,50.24 129.35,50.24 arc-90 129.86,49.73 129.86,45.99 arc90 130.06,45.78 130.22,45.78 arc90 130.43,45.99 130.43,49.73 arc-90 130.93,50.24 131.09,50.24 arc-90 131.6,49.73 131.6,45.99 arc90 131.81,45.78 131.97,45.78 arc90 132.17,45.99 132.17,49.73 arc-90 132.68,50.24 arc45 133.11,50.42 137.12,54.43 arc-45 137.55,54.61 138.16,54.61 arc-90 138.67,54.1 138.67,53.94 arc90 138.87,53.73 139.01,53.73 arc90 139.22,53.94 139.22,54.1 arc-90 139.73,54.61 139.87,54.61 arc-90 140.38,54.1 140.38,53.94 arc90 140.58,53.73 140.73,53.73 arc90 140.93,53.94 140.93,54.1 arc-90 141.44,54.61 141.59,54.61 arc-90 142.09,54.1 142.09,53.94 arc90 142.3,53.73 142.44,53.73 arc90 142.65,53.94 142.65,54.1 arc-90 143.15,54.61 144.88,54.61 arc90 145.14,54.86 145.14,64.36 arc-90 145.75,64.97 147.21,64.97 arc90 147.41,65.18 147.41,65.73 arc-90 147.92,66.24 148.05,66.24 arc-90 148.56,65.73 arc90 148.76,65.53 148.88,65.53 arc90 149.09,65.73 arc-90 149.59,66.24 149.72,66.24 arc-90 150.23,65.73 150.23,65.64 arc90 150.43,65.44 150.56,65.44 arc90 150.76,65.64 150.76,65.73 arc-90 151.27,66.24 151.39,66.24 arc-90 151.9,65.73 151.9,65.18 arc90 152.1,64.97 152.23,64.97 arc90 152.43,65.18 152.43,65.73 arc-90 152.94,66.24 153.06,66.24 arc-90 153.57,65.73 153.57,65.18 arc90 153.78,64.97 153.9,64.97 arc90 154.1,65.18 154.1,65.73 arc-90 154.61,66.24 154.74,66.24 arc-90 155.25,65.73 155.25,65.18 arc90 155.45,64.97 156.68,64.97 arc-45 157.11,64.8 157.56,64.35 arc-45 157.73,63.92 157.73,63.18 arc-45 157.56,62.75 157.42,62.61 arc-45 156.99,62.43 156.36,62.43 156.32,62.39 arc-45 155.89,62.21 QSE_J401.44
  Bottom_SIG4 0.152: v119.84,50.24 119.83,50.24 JA1:FMC1.H5
CLK0_M2C_P  (via drill 0.2 pad 0.25)
  Top_SIG1 0.102: 153.91,63.01 QSE_J401.42 155.84,63.01 arc-45 156.27,62.83 156.36,62.74 156.89,62.74 arc45 157.27,62.9 arc45 157.43,63.28 157.43,63.82 arc45 157.27,64.2 156.99,64.49 arc45 156.56,64.67 155.45,64.67 arc-90 154.94,65.18 154.94,65.73 arc90 154.74,65.94 154.61,65.94 arc90 154.41,65.73 154.41,65.18 arc-90 153.9,64.67 153.78,64.67 arc-90 153.27,65.18 153.27,65.73 arc90 153.06,65.94 152.94,65.94 arc90 152.74,65.73 152.74,65.18 arc-90 152.23,64.67 152.1,64.67 arc-90 151.59,65.18 151.59,65.73 arc90 151.39,65.94 151.27,65.94 arc90 151.06,65.73 151.06,65.18 arc-90 150.56,64.67 150.43,64.67 arc-90 149.92,65.18 149.92,65.73 arc90 149.72,65.94 149.59,65.94 arc90 149.39,65.73 149.39,65.18 arc-90 148.88,64.67 148.76,64.67 arc-90 148.25,65.18 148.25,65.73 arc90 148.05,65.94 147.92,65.94 arc90 147.72,65.73 147.72,65.18 arc-90 147.21,64.67 146.05,64.67 arc90 145.44,64.06 145.44,54.86 arc-90 144.88,54.3 143.15,54.3 arc90 142.95,54.1 142.95,53.94 arc-90 142.44,53.43 142.3,53.43 arc-90 141.79,53.94 141.79,54.1 arc90 141.59,54.3 141.44,54.3 arc90 141.24,54.1 141.24,53.94 arc-90 140.73,53.43 140.58,53.43 arc-90 140.07,53.94 140.07,54.09 arc90 139.87,54.29 139.73,54.29 arc90 139.52,54.09 139.52,53.94 arc-90 139.01,53.43 138.87,53.43 arc-90 138.36,53.94 138.36,54.1 arc90 138.16,54.3 137.68,54.3 arc45 137.25,54.13 133.24,50.12 arc-45 132.81,49.94 132.68,49.94 arc90 132.48,49.73 132.48,45.99 arc-90 131.97,45.48 131.81,45.48 arc-90 131.3,45.99 131.3,49.73 arc90 131.09,49.94 130.93,49.94 arc90 130.73,49.73 130.73,45.99 arc-90 130.22,45.48 130.06,45.48 arc-90 129.55,45.99 129.55,49.73 arc90 129.35,49.94 129.12,49.94 arc-45 128.69,50.12 128.17,50.63 arc45 127.74,50.81 121.07,50.81 arc90 120.75,50.5 arc90 120.97,50.28 v121.03,50.24
  Bottom_SIG4 0.102: JA1:FMC1.H4 v121.03,50.24
  Bottom_SIG4 0.152: v121.03,50.24
CLK1_M2C_N  (via drill 0.2 pad 0.51 layers 1-3, 0.2 pad 0.51 layers 3-16)
  Top_SIG1 0.102: QSE_J401.74 156.44,50.21 arc-45 v156.47,50.21
  3_SIG2 0.102: v156.47,50.21 155.93,50.47 152.54,50.47 arc-45 152.11,50.65 151.16,51.6 arc45 150.94,51.69 144.06,51.69 141.39,49.02 141.26,49.02 arc90 141.06,48.82 141.06,47.87 arc-90 140.55,47.37 140.47,47.37 arc-90 139.96,47.87 139.96,50.48 arc90 139.76,50.68 139.68,50.68 arc90 139.48,50.48 139.48,47.87 arc-90 138.97,47.37 138.89,47.37 arc-90 138.38,47.87 138.38,50.48 arc90 138.18,50.68 138.1,50.68 arc90 137.89,50.48 137.89,47.87 arc-90 137.39,47.37 137.31,47.37 arc-90 136.8,47.87 136.8,50.48 arc90 136.59,50.68 136.51,50.68 arc90 136.31,50.48 136.31,47.87 arc-90 135.8,47.37 135.72,47.37 arc-90 135.22,47.87 135.22,50.48 arc90 135.01,50.68 134.93,50.68 arc90 134.73,50.48 134.73,47.87 arc-90 134.22,47.37 134.14,47.37 arc-90 133.63,47.87 133.63,50.48 arc90 133.43,50.68 133.35,50.68 arc90 133.15,50.48 133.15,47.87 arc-90 132.64,47.37 132.56,47.37 arc-90 132.05,47.87 132.05,50.48 arc90 131.85,50.68 131.77,50.68 arc90 131.56,50.48 131.56,47.87 arc-90 131.06,47.37 130.98,47.37 arc-90 130.47,47.87 130.47,50.11 arc90 130.26,50.32 130.19,50.32 arc90 129.98,50.11 129.98,47.87 arc-90 129.47,47.37 129.39,47.37 arc-90 128.89,47.87 128.89,48.82 arc90 128.68,49.02 128.31,49.02 arc-45 127.88,49.2 127.22,49.86 arc45 126.79,50.04 125.16,50.04 arc-45 124.73,50.22 124.35,50.59 arc45 123.97,50.75 123.45,50.75 arc-90 122.84,51.36 122.84,51.46 arc91 122.69,51.61 122.38,51.61 v122.4,51.61 122.38,51.59
  Bottom_SIG4 0.102: v122.4,51.61 122.25,51.5 JA1:FMC1.G3
CLK1_M2C_P  (via drill 0.2 pad 0.51 layers 1-3, 0.2 pad 0.51 layers 3-16)
  Top_SIG1 0.102: QSE_J401.72 156.44,51.01 arc-45 v156.47,51.01
  3_SIG2 0.102: v156.47,51.01 155.93,50.77 152.54,50.77 arc-45 152.32,50.86 151.37,51.81 arc45 150.94,51.99 143.93,51.99 141.26,49.33 arc90 140.75,48.82 140.75,47.87 arc-90 140.55,47.67 140.47,47.67 arc-90 140.27,47.87 140.27,50.48 arc90 139.76,50.98 139.68,50.98 arc90 139.17,50.48 139.17,47.87 arc-90 138.97,47.67 138.89,47.67 arc-90 138.69,47.87 138.69,50.48 arc90 138.18,50.98 138.1,50.98 arc90 137.59,50.48 137.59,47.87 arc-90 137.39,47.67 137.31,47.67 arc-90 137.1,47.87 137.1,50.48 arc90 136.59,50.98 136.51,50.98 arc90 136.01,50.48 136.01,47.87 arc-90 135.8,47.67 135.72,47.67 arc-90 135.52,47.87 135.52,50.48 arc90 135.01,50.98 134.93,50.98 arc90 134.43,50.48 134.43,47.87 arc-90 134.22,47.67 134.14,47.67 arc-90 133.94,47.87 133.94,50.48 arc90 133.43,50.98 133.35,50.98 arc90 132.84,50.48 132.84,47.87 arc-90 132.64,47.67 132.56,47.67 arc-90 132.36,47.87 132.36,50.48 arc90 131.85,50.98 131.77,50.98 arc90 131.26,50.48 131.26,47.87 arc-90 131.06,47.67 130.98,47.67 arc-90 130.77,47.87 130.77,50.48 arc90 130.26,50.98 130.19,50.98 arc90 129.68,50.48 129.68,47.87 arc-90 129.47,47.67 129.39,47.67 arc-90 129.19,47.87 129.19,48.82 arc90 128.68,49.33 128.42,49.33 arc-45 128.01,49.5 127.34,50.16 arc45 126.91,50.34 125.28,50.34 arc-45 124.85,50.52 124.5,50.88 arc45 124.07,51.05 123.53,51.05 arc-45 123.32,51.14 123.24,51.22 arc-69 123.22,51.44 arc-66 123.38,51.61 v123.62,51.61
  Bottom_SIG4 0.102: v123.62,51.61 123.55,51.52 JA1:FMC1.G2
CLK2_M2C_N  (via drill 0.2 pad 0.51)
  Top_SIG1 0.102: QSE_J402.44 46.44,62.21 arc45 v46.48,62.23
  Bottom_SIG4 0.102: 119.23,47.12 arc-90 119.2,47.14 119.41,46.53 72.3,46.53 arc-45 71.87,46.71 70.56,48.02 | v46.48,62.23 46.46,62.23 47.98,61.98 arc9 48.03,61.97 48.92,61.97 49.02,61.98 49.12,61.98 arc-41 49.32,61.9 49.68,61.59 64.55,51.93 arc90 64.83,51.98 65.2,52.56 arc-90 65.48,52.62 65.8,52.41 arc-90 65.86,52.13 65.49,51.56 arc90 65.55,51.27 65.87,51.08 arc90 66.15,51.13 66.36,51.44 arc-90 67.06,51.59 67.38,51.38 arc-90 67.53,50.68 67.32,50.37 arc90 67.41,50.08 70.56,48.02 | v46.48,62.23 | 70.56,48.02 70.61,48.06
  Bottom_SIG4 0.152: 119.23,47.12 119.2,47.14 JA1:FMC1.K5
CLK2_M2C_P  (via drill 0.2 pad 0.51)
  Top_SIG1 0.102: QSE_J402.42 46.51,63.01 46.51,62.99
  Top_SIG1 0.152: 46.51,62.99 v46.48,62.99
  Bottom_SIG4 0.102: v46.48,62.99 46.52,63 arc-56 46.51,63 46.51,62.98 46.23,62.82 arc26 46.14,62.74 46.02,62.55 arc34 45.97,62.41 45.97,61.98 arc90 46.23,61.72 46.58,61.72 arc45 46.76,61.8 arc-54 46.83,61.82 47.99,61.63 arc9 48.04,61.63 48.97,61.63 48.92,61.62 49.05,61.62 arc-40 49.25,61.55 49.47,61.34 64.37,51.67 65.7,50.81 arc90 66.41,50.96 arc-90 66.69,51.02 67.01,50.81 arc-90 67.07,50.53 arc90 67.22,49.83 70.34,47.8 arc-12 70.39,47.76 71.74,46.41 arc45 72.17,46.23 119.55,46.23 JA1:FMC1.K4
  Bottom_SIG4 0.152: 120.31,47.12 120.41,47.12 JA1:FMC1.K4
CLK3_M2C_N  (via drill 0.2 pad 0.51, 0.2 pad 0.51 layers 3-16)
  Top_SIG1 0.102: QSE_J402.74 v46.47,50.2
  3_SIG2 0.102: 121.14,45.64 121.14,45.67 | 121.14,45.67 v121.17,45.67 | 121.14,45.67 121.14,45.92 arc-45 121.23,46.14 122.23,47.14 122.26,47.15 arc64 122.42,47.43 v122.4,47.78
  Bottom_SIG4 0.102: v46.47,50.2 arc-83 46.78,50.47 46.91,50.47 arc-90 47.11,50.27 47.11,49.57 arc90 47.32,49.37 47.75,49.37 arc90 47.95,49.57 47.95,50.27 arc-90 48.16,50.47 48.21,50.47 arc-22 48.33,50.45 48.59,50.34 arc22 48.7,50.32 48.99,50.32 arc-22 49.11,50.29 54.1,48.23 55.11,47.81 56.47,47.24 arc23 73.94,43.76 113.39,43.76 113.38,43.76 113.39,43.76 115.21,43.76 116.08,43.75 arc51 121.17,45.64 | v121.17,45.67 arc50 121.16,45.65 121.16,45.64 121.17,45.64 | 121.17,45.64 121.18,45.65
  Bottom_SIG4 0.152: v122.4,47.78 122.09,48.08 JA1:FMC1.J3
CLK3_M2C_P  (via drill 0.2 pad 0.51, 0.2 pad 0.51 layers 3-16)
  Top_SIG1 0.102: QSE_J402.72 v46.47,51
  3_SIG2 0.102: v120.43,45.67 | v120.43,45.67 120.43,45.77 121.88,47.22 arc64 121.95,47.53 121.94,47.58 arc-19 121.92,47.68 121.92,47.94 arc-20 121.94,48.04 121.99,48.19 arc-25 122.06,48.3 122.19,48.43 arc-19 122.27,48.49 v123.51,49.09
  Bottom_SIG4 0.102: v46.47,51 46.46,51 46.7,50.94 arc44 46.92,50.85 47.08,50.84 arc-90 47.33,50.64 arc90 47.52,50.43 47.54,50.43 arc90 47.75,50.62 arc-90 47.96,50.82 48.33,50.79 arc-22 48.44,50.76 48.73,50.65 arc22 48.85,50.62 49.12,50.62 arc-22 49.23,50.6 54.22,48.53 55.23,48.11 56.7,47.55 arc23 74.19,44.07 113.16,44.07 116.47,44.09 arc53 120.52,45.7 v120.43,45.67 | v123.51,49.09 JA1:FMC1.J2
EXP1_SE_CLK_IN  (via drill 0.2 pad 0.51 layers 1-3, 0.2 pad 0.51 layers 1-5, 0.2 pad 0.51 layers 3-16)
  Top_SIG1 0.102: QSE_J401.43 147.33,62.21 v147.16,62.19 | v97.94,61.77 v93.47,61.57
  3_SIG2 0.102: v112.37,62.89 113.55,62.6 arc-31 113.62,62.56 113.88,62.29 arc10 113.9,62.27 114.14,62.11 arc90 114.42,62.16 114.72,62.57 arc-90 115,62.62 115.08,62.56 arc-90 115.13,62.28 114.84,61.86 arc90 114.89,61.58 115.58,61.09 arc35 115.67,61.06 145.9,61.06 arc45 146.11,61.15 v147.16,62.19 | v93.47,61.57 85.46,60.47 arc82 84.94,59.87 84.94,51.61 arc-90 84.33,51 82.55,51 arc45 82.12,50.83 81.64,50.34 v81.66,50.38
  5_SIG3 0.102: v112.37,62.89 109.78,61.9 arc-21 109.67,61.87 106.81,61.87 arc-90 106.61,62.08 106.61,62.2 arc90 106.41,62.4 106.37,62.4 arc90 106.17,62.2 106.17,62.08 arc-90 105.96,61.87 105.93,61.87 arc-90 105.72,62.08 105.72,62.2 arc90 105.52,62.4 105.48,62.4 arc90 105.28,62.2 105.28,62.08 arc-90 105.08,61.87 105.04,61.87 arc-90 104.84,62.08 104.84,62.2 arc90 104.63,62.4 104.59,62.4 arc90 104.39,62.2 104.39,62.08 arc-90 104.19,61.87 104.15,61.87 arc-90 103.95,62.08 103.95,62.2 arc90 103.74,62.4 103.71,62.4 arc90 103.5,62.2 103.5,62.08 arc-90 103.3,61.87 103.26,61.87 arc-90 103.06,62.08 103.06,62.2 arc90 102.86,62.4 102.82,62.4 arc90 102.62,62.2 102.62,62.08 arc-90 102.41,61.87 v97.94,61.77
  Bottom_SIG4 0.102: v81.66,50.38 v81.65,50.38 JA1:FMC1.H35
EXP1_SE_CLK_OUT  (via drill 0.2 pad 0.51 layers 1-3, 0.2 pad 0.51 layers 1-5, 0.2 pad 0.51 layers 5-16)
  Top_SIG1 0.102: v83.62,60.55 v98.04,60.55 | QSE_J401.49 147.2,59.81 arc45 v147.16,59.79
  3_SIG2 0.102: v112.37,61.77 113.8,59.96 arc52 114.04,59.84 117.73,59.84 arc45 117.95,59.93 117.97,59.96 arc-45 118.19,60.05 134.09,60.05 arc45 134.12,60.06 146.76,60.06 arc-45 146.98,59.97 v147.16,59.79
  5_SIG3 0.102: v112.37,61.77 111.63,61.57 arc28 111.49,61.53 110,61 arc-28 109.86,60.96 108.51,60.96 arc90 108.31,60.76 108.31,60.43 arc-90 108.1,60.22 108.07,60.22 arc-90 107.86,60.43 107.86,60.76 arc90 107.66,60.96 107.63,60.96 arc90 107.42,60.76 107.42,60.43 arc-90 107.22,60.22 107.19,60.22 arc-90 106.98,60.43 106.98,60.76 arc90 106.78,60.96 106.75,60.96 arc90 106.54,60.76 106.54,60.43 arc-90 106.34,60.22 106.31,60.22 arc-90 106.1,60.43 106.1,60.76 arc90 105.9,60.96 105.87,60.96 arc90 105.66,60.76 105.66,60.43 arc-90 105.46,60.22 105.42,60.22 arc-90 105.22,60.43 105.22,60.76 arc90 105.02,60.96 104.98,60.96 arc90 104.78,60.76 104.78,60.43 arc-90 104.58,60.22 104.55,60.22 arc-90 104.34,60.43 104.34,60.76 arc90 104.14,60.96 104.1,60.96 arc90 103.9,60.76 103.9,60.43 arc-90 103.7,60.22 103.66,60.22 arc-90 103.46,60.43 103.46,60.76 arc90 103.26,60.96 98.58,60.96 arc45 98.36,60.87 v98.04,60.55 | v83.11,51.61 arc-45 83.18,51.79 83.53,52.13 arc45 83.62,52.35 v83.62,60.55
  Bottom_SIG4 0.102: JA1:FMC1.G34 82.47,50.97 v83.11,51.61
EXP1_SE_IO_0
  Top_SIG1 0.102: 154.7,82.93 156.01,82.93 arc-53 156.25,82.81 156.28,82.77 arc53 156.77,82.53 170.91,82.56 arc45 171.35,82.81 172.06,83.52 JP2_EXT1_GPIOS.3
  Top_SIG1 0.152: 154.7,82.93 QSE_J401.2
EXP1_SE_IO_1  (via drill 0.2 pad 0.51 layers 1-3)
  Top_SIG1 0.152: v147.14,83.03 v147.13,83.02 149.07,83.06 QSE_J401.1
  3_SIG2 0.102: v147.14,83.03 v147.14,83.02 arc29 147.28,82.72 148.23,82.72 168.65,82.7 arc65 169.2,83.05 JP2_EXT1_GPIOS.4
EXP1_SE_IO_2
  Top_SIG1 0.102: JP2_EXT1_GPIOS.5 171.2,82.03 arc45 170.77,82.21 164.82,82.21 arc90 164.63,82.02 arc-90 164.44,81.83 162.87,81.83 arc-90 162.67,82.02 arc90 162.48,82.21 QSE_J401.4
EXP1_SE_IO_3  (via drill 0.2 pad 0.51 layers 1-3)
  Top_SIG1 0.152: QSE_J401.3 149,82.22 147.17,82.23 v147.17,82.22
  3_SIG2 0.102: v147.17,82.22 147.14,82.19 arc-68 147.37,82.4 164.06,82.39 arc-90 164.23,82.22 arc90 164.39,82.06 165.28,82.06 arc90 165.44,82.22 arc-90 165.61,82.39 168.62,82.39 arc-68 169.18,82.01 JP2_EXT1_GPIOS.6
EXP1_SE_IO_4
  Top_SIG1 0.102: JP2_EXT1_GPIOS.9 171.41,76.1 arc51 170.94,75.87 170.36,75.16 arc-51 169.89,74.93 168.33,74.93 arc-47 168.11,75.03 163.04,80.39 arc45 162.61,80.57 154.66,80.57
  Top_SIG1 0.152: 154.66,80.57 QSE_J401.8
EXP1_SE_IO_5  (via drill 0.2 pad 0.51)
  Top_SIG1 0.152: QSE_J401.7 v150.86,80.62
  3_SIG2 0.102: v150.86,80.62 arc45 150.87,80.59 162.68,80.57 arc-47 163.12,80.38 168.11,75.1 arc47 168.33,75.01 168.86,75.01 arc85 169.47,75.56 JP2_EXT1_GPIOS.10
EXP1_SE_IO_6
  Top_SIG1 0.102: QSE_J401.10 155.88,79.81 arc50 156.35,80.03 156.36,80.04 arc-50 156.88,80.23 162.58,80.26 arc-47 162.8,80.17 167.87,74.82 arc47 168.31,74.62 170.7,74.62 arc-43 171.12,74.46 172.06,73.58 JP2_EXT1_GPIOS.11
EXP1_SE_IO_7  (via drill 0.2 pad 0.51)
  Top_SIG1 0.152: v150.88,79.82 QSE_J401.9
  3_SIG2 0.102: JP2_EXT1_GPIOS.12 169.51,74.11 arc89 168.9,74.7 168.31,74.7 arc-47 167.87,74.89 162.88,80.17 arc47 162.66,80.25 152.1,80.2 151.83,80.19 151.16,80.2 v150.88,79.82
EXP1_SE_IO_8  (via drill 0.2 pad 0.2 layers 1-5)
  Top_SIG1 0.102: QSE_J401.14 158.29,78.23 arc90 v158.5,78.69
  5_SIG3 0.102: JP2_EXT1_GPIOS.15 171.15,67.55 arc-45 170.69,67.36 168.22,67.36 arc-45 168.03,67.47 165.62,69.89 arc-45 165.53,70.1 165.53,70.13 arc-90 165.72,70.32 arc90 165.91,70.51 165.91,70.84 arc90 165.72,71.03 arc-90 165.53,71.22 165.53,74.69 arc44 165.36,75.11 162.58,78.03 arc45 162.15,78.21 158.7,78.24 arc-90 v158.5,78.69
EXP1_SE_IO_9  (via drill 0.2 pad 0.51)
  Top_SIG1 0.102: QSE_J401.13 v150.86,78.21
  5_SIG3 0.102: v150.86,78.21 152.98,77.76 arc10 153.09,77.75 157.12,77.75 arc-57 157.63,77.47 158.82,76.26 arc90 159.06,76.26 159.25,76.45 arc-90 159.48,76.44 159.53,76.39 arc-90 159.53,76.16 159.34,75.97 arc90 159.34,75.73 159.4,75.68 arc90 159.63,75.68 159.82,75.87 arc-90 160.05,75.86 160.11,75.81 arc-90 160.1,75.57 159.91,75.39 arc90 159.91,75.15 159.97,75.1 arc90 160.2,75.1 160.39,75.28 arc-90 160.62,75.28 160.68,75.23 arc-90 160.68,74.99 160.49,74.81 arc90 160.48,74.57 160.54,74.52 arc90 160.77,74.52 160.96,74.7 arc-90 161.19,74.7 161.25,74.65 arc-90 161.25,74.41 161.06,74.23 arc90 161.06,73.99 163.83,71.17 arc-26 163.9,71.05 167.47,60.13 arc72 167.76,59.92 168.9,59.92 arc88 169.51,60.51 JP2_EXT1_GPIOS.22
EXP1_SE_IO_10  (via drill 0.2 pad 0.2 layers 1-5)
  Top_SIG1 0.102: 154.66,77.37 156,77.63 arc43 156.38,77.87 arc-54 156.44,77.9 158.29,77.93 arc-91 v158.5,77.65
  Top_SIG1 0.152: QSE_J401.16 154.66,77.37
  5_SIG3 0.102: v158.5,77.65 arc-90 158.71,77.91 162.12,77.9 arc-46 162.34,77.81 163.31,76.79 arc-90 163.31,76.56 arc90 163.3,76.32 164.05,75.53 arc90 164.29,75.53 arc-90 164.52,75.52 165.14,74.87 arc-44 165.23,74.66 165.23,70.08 arc45 165.41,69.65 167.74,67.26 arc45 168.19,67.06 170.7,67.06 arc-45 171.12,66.9 172.06,65.96
  5_SIG3 0.406: JP2_EXT1_GPIOS.17 172.06,65.96
EXP1_SE_IO_11  (via drill 0.2 pad 0.51)
  Top_SIG1 0.152: v147.16,77.42 QSE_J401.15
  5_SIG3 0.102: JP2_EXT1_GPIOS.24 169.51,59.02 arc89 168.9,59.61 167.42,59.61 arc-70 167.13,59.82 166.73,60.96 163.6,70.75 arc26 163.53,70.87 160.22,74.27 157.39,77.29 arc61 157.12,77.44 v147.16,77.42
EXP1_SE_IO_28  (via drill 0.2 pad 0.51 layers 1-3)
  Top_SIG1 0.102: QSE_J401.41 v150.84,63.02
  3_SIG2 0.102: v150.84,63.02 150.88,62.99 152.81,61.54 arc33 153.14,61.44 164.13,61.44 arc-46 164.57,61.26 168.17,57.52 arc46 168.67,57.3 170.05,57.3 arc45 170.28,57.51 170.76,57.99 arc45 170.87,58.42 170.87,59.92 arc-90 171.1,60.15 arc45 171.53,60.33 JP2_EXT1_GPIOS.21
EXP1_SE_IO_29  (via drill 0.2 pad 0.51 layers 1-3)
  Top_SIG1 0.152: QSE_J401.47 150.59,60.61 v150.84,60.6
  3_SIG2 0.102: v150.84,60.6 151.41,60.6 arc-45 151.84,60.43 153.09,59.18 arc45 153.52,59 161.42,59 arc-90 161.61,58.81 161.61,58.74 arc90 161.8,58.55 161.81,58.55 arc90 162,58.74 162,58.81 arc-90 162.19,59 162.2,59 arc-90 162.39,58.81 162.39,58.74 arc90 162.58,58.55 162.59,58.55 arc90 162.78,58.74 162.78,58.81 arc-90 162.97,59 162.98,59 arc-90 163.17,58.81 163.17,58.74 arc90 163.36,58.55 163.37,58.55 arc90 163.56,58.74 163.56,58.81 arc-90 163.75,59 163.76,59 arc-90 163.95,58.81 163.95,58.74 arc90 164.14,58.55 164.15,58.55 arc90 164.34,58.74 164.34,58.81 arc-90 164.53,59 164.54,59 arc-90 164.73,58.81 164.73,58.74 arc90 164.92,58.55 164.93,58.55 arc90 165.12,58.74 165.12,58.81 arc-90 165.31,59 166.09,59 arc-45 166.31,58.91 168.25,56.97 arc45 168.68,56.79 170.28,56.79 arc45 170.71,56.97 JP2_EXT1_GPIOS.23
EXP2_SE_CLK_IN  (via drill 0.2 pad 0.51 layers 1-5, 0.2 pad 0.51 layers 5-16)
  Top_SIG1 0.102: QSE_J402.43 v37.11,62.2
  5_SIG3 0.102: v37.11,62.2 41.67,61.6 arc8 41.75,61.59 46.24,61.59 | 46.24,61.59 | 46.24,61.59 55.35,60.18 arc-90 55.52,59.95 55.52,59.94 arc90 55.69,59.7 56.73,59.54 arc90 56.96,59.71 56.96,59.73 arc-90 57.19,59.9 57.47,59.86 58.09,59.76 arc-90 58.25,59.55 58.12,58.62 arc90 58.29,58.4 58.3,58.4 arc90 58.52,58.56 58.65,59.49 arc-90 58.86,59.65 58.88,59.65 arc-90 59.04,59.44 58.91,58.51 arc90 59.08,58.29 59.09,58.29 arc90 59.31,58.45 59.44,59.38 arc-90 59.65,59.54 59.67,59.54 arc-90 59.83,59.33 59.7,58.4 arc90 59.87,58.18 59.88,58.18 arc90 60.1,58.34 60.23,59.27 arc-90 60.44,59.44 60.46,59.43 arc-90 60.62,59.22 60.49,58.29 arc90 60.65,58.07 60.67,58.07 arc90 60.89,58.23 61.01,59.16 arc-90 61.23,59.33 61.25,59.32 arc-90 61.41,59.11 61.28,58.18 arc90 61.44,57.96 61.46,57.96 arc90 61.68,58.12 61.8,59.05 arc-90 62.02,59.22 62.04,59.22 arc-90 62.2,59 62.07,58.07 arc90 62.23,57.86 62.25,57.85 arc90 62.46,58.02 62.59,58.95 arc-90 62.81,59.11 62.83,59.11 arc-90 62.99,58.89 62.86,57.96 arc90 63.02,57.75 63.04,57.74 arc90 63.25,57.91 63.38,58.84 arc-90 63.6,59 63.61,59 arc-90 63.78,58.78 63.65,57.85 arc90 63.81,57.64 63.83,57.63 arc90 64.04,57.8 64.17,58.73 arc-90 64.39,58.89 64.4,58.89 arc-90 64.57,58.67 64.44,57.74 arc90 64.6,57.53 64.62,57.53 arc90 64.83,57.69 64.96,58.62 arc-90 65.18,58.78 65.19,58.78 arc-90 65.36,58.56 65.23,57.63 arc90 65.39,57.42 65.41,57.42 arc90 65.62,57.58 65.75,58.51 arc-90 65.97,58.67 65.98,58.67 arc-90 66.15,58.46 66.02,57.52 arc90 66.18,57.31 66.2,57.31 arc90 66.41,57.47 66.54,58.4 arc-90 66.75,58.56 66.77,58.56 arc-90 66.93,58.35 66.81,57.42 arc90 66.97,57.2 66.98,57.2 arc90 67.2,57.36 67.33,58.29 arc-90 67.54,58.45 67.56,58.45 arc-90 67.72,58.24 67.59,57.31 arc90 67.76,57.09 67.78,57.09 arc90 67.99,57.25 68.12,58.18 arc-90 68.33,58.35 68.35,58.34 arc-90 68.51,58.13 68.38,57.2 arc90 68.55,56.98 68.56,56.98 arc90 68.78,57.14 68.91,58.07 arc-90 69.12,58.24 69.14,58.23 arc-90 69.3,58.02 69.17,57.09 arc90 69.34,56.87 69.35,56.87 arc90 69.57,57.04 69.7,57.97 arc-90 69.91,58.13 70.74,58.01 74.08,54.46 arc-43 74.24,54.04 74.24,53.01 arc45 74.42,52.58 74.53,52.47 arc44 74.95,52.29 78.38,52.23 arc-48 78.6,52.12 v79.15,51.61
  Bottom_SIG4 0.102: JA1:FMC1.G37 v79.15,51.61
EXP2_SE_CLK_OUT  (via drill 0.2 pad 0.51 layers 1-5, 0.2 pad 0.51 layers 5-16)
  Top_SIG1 0.102: v37.16,59.79 QSE_J402.49
  5_SIG3 0.102: v77.93,50.37 77.4,50.83 arc45 76.96,51 68.53,51 arc-90 68.34,51.19 68.34,51.22 arc90 68.15,51.41 67.66,51.41 arc90 67.47,51.22 67.47,51.19 arc-90 67.27,51 66.78,51 arc-90 66.59,51.19 66.59,51.22 arc90 66.4,51.41 65.91,51.41 arc90 65.72,51.22 65.72,51.19 arc-90 65.53,51 65.03,51 arc-90 64.84,51.19 64.84,51.22 arc90 64.65,51.41 64.16,51.41 arc90 63.97,51.22 63.97,51.19 arc-90 63.78,51 61.91,51 arc-90 61.72,51.19 61.72,53.54 arc90 61.52,53.73 61.48,53.73 arc90 61.29,53.54 61.29,51.19 arc-90 61.1,51 61.06,51 arc-90 60.87,51.19 60.87,53.54 arc90 60.68,53.73 60.64,53.73 arc90 60.45,53.54 60.45,51.19 arc-90 60.26,51 60.22,51 arc-90 60.03,51.19 60.03,53.54 arc90 59.84,53.73 59.79,53.73 arc90 59.6,53.54 59.6,51.19 arc-90 59.41,51 59.37,51 arc-90 59.18,51.19 59.18,53.54 arc90 58.99,53.73 58.95,53.73 arc90 58.76,53.54 58.76,51.19 arc-90 58.57,51 58.53,51 arc-90 58.34,51.19 58.34,53.54 arc90 58.15,53.73 58.1,53.73 arc90 57.91,53.54 57.91,51.19 arc-90 57.72,51 57.68,51 arc-90 57.49,51.19 57.49,53.54 arc90 57.3,53.73 57.26,53.73 arc90 57.07,53.54 57.07,51.19 arc-90 56.88,51 56.84,51 arc-90 56.65,51.19 56.65,53.54 arc90 56.45,53.73 56.41,53.73 arc90 56.22,53.54 56.22,51.19 arc-90 56.03,51 51.53,51 arc-40 51.14,51.15 40.89,59.7 arc40 40.5,59.84 v37.16,59.79
  Bottom_SIG4 0.102: JA1:FMC1.H38 77.89,50.32 v77.93,50.37
EXP2_SE_IO_0  (via drill 0.2 pad 0.51 layers 1-3)
  Top_SIG1 0.152: v46.46,83.02 QSE_J402.2
  3_SIG2 0.102: JP1_EXT2_GPIOS.3 29.43,83.25 arc53 29.92,83.01 36.73,83.01 arc-45 37.16,82.83 37.27,82.72 arc45 37.49,82.63 42.02,82.63 arc40 42.41,82.77 42.53,82.87 arc-40 42.92,83.01 44.55,83.01 QSE_J402.2 45.97,83.01 v46.46,83.02
EXP2_SE_IO_1
  Top_SIG1 0.102: QSE_J402.1 37.59,83.01 arc90 37.29,83.31 26.57,83.31 arc-90 25.96,83.84 JP1_EXT2_GPIOS.4
EXP2_SE_IO_2  (via drill 0.2 pad 0.51 layers 1-3)
  Top_SIG1 0.152: v46.48,82.19 44.65,82.25 QSE_J402.4
  3_SIG2 0.102: v46.48,82.19 46.39,82.23 arc45 45.97,82.32 37.46,82.32 arc-45 37.03,82.5 36.92,82.61 arc45 36.7,82.7 33.38,82.7 arc90 33.19,82.51 33.19,82.25 arc-90 33,82.06 31.19,82.06 arc-90 31,82.25 31,82.51 arc90 30.81,82.7 29.67,82.7 arc37 29.3,82.58 JP1_EXT2_GPIOS.5
EXP2_SE_IO_3
  Top_SIG1 0.102: 38.98,82.25 37.59,82.25 37.59,82.37 arc90 37.52,82.45 arc-90 37.26,82.7 arc90 36.96,83.01 26.65,83.01 arc90 25.96,82.32 JP1_EXT2_GPIOS.6
  Top_SIG1 0.152: 38.98,82.25 QSE_J402.3
EXP2_SE_IO_4  (via drill 0.2 pad 0.51 layers 1-3)
  Top_SIG1 0.152: QSE_J402.8 42.83,80.61 v42.75,80.63
  3_SIG2 0.102: JP1_EXT2_GPIOS.9 29.19,76.2 arc90 30.05,76.2 32.54,78.69 arc90 32.54,78.96 arc-90 32.54,79.23 32.84,79.53 arc-90 33.11,79.53 arc90 33.38,79.53 34.57,80.72 42.22,80.72 arc-45 42.75,80.64 arc62 42.78,80.62 v42.75,80.63
EXP2_SE_IO_5
  Top_SIG1 0.102: JP1_EXT2_GPIOS.10 25.93,76.91 26.52,75.98 arc58 27.03,75.69 29.49,75.69 arc45 29.92,75.87 34.44,80.39 arc-45 34.87,80.57 37.16,80.57 arc-45 37.38,80.48 arc45 37.56,80.4 38.81,80.4 QSE_J402.7
EXP2_SE_IO_6  (via drill 0.2 pad 0.51 layers 1-3)
  Top_SIG1 0.152: QSE_J402.10 42.93,79.81 v42.77,79.81
  3_SIG2 0.102: v42.77,79.81 42.62,79.86 42.32,80.31 arc48 42.09,80.42 34.85,80.42 arc45 34.63,80.33 29.82,75.54 29.54,75.31 JP1_EXT2_GPIOS.11
EXP2_SE_IO_7
  Top_SIG1 0.102: JP1_EXT2_GPIOS.12 26.41,75.13 arc-55 26.91,75.39 29.75,75.39 arc45 30.14,75.58 34.61,80.1 arc-45 34.98,80.26 36.89,80.26 arc-45 37.11,80.18 37.15,80.14 arc45 37.36,80.05 37.38,80.05 arc-45 37.59,79.96 37.82,79.73
  Top_SIG1 0.152: 37.82,79.73 QSE_J402.9
EXP2_SE_IO_8  (via drill 0.2 pad 0.51 layers 1-3)
  Top_SIG1 0.152: QSE_J402.14 43.28,78.21 v42.75,78.21
  3_SIG2 0.102: v42.75,78.21 42.58,78.33 36.93,78.28 arc45 36.5,78.1 35.48,77.09 arc45 35.31,76.66 35.31,73.98 arc-43 35.22,73.78 30.06,68.25 arc-47 29.84,68.15 28.98,68.15 arc24 28.97,68.2 JP1_EXT2_GPIOS.15
EXP2_SE_IO_9
  Top_SIG1 0.102: JP1_EXT2_GPIOS.16 26.89,68.34 arc45 27.32,68.16 29.85,68.16 arc45 30.07,68.25 35.37,73.62 arc45 35.46,73.84 35.46,76.13 arc-90 37.33,78 37.49,78 37.59,78.11 37.59,78.21 QSE_J402.13
  Top_SIG1 0.152: QSE_J402.13
EXP2_SE_IO_10  (via drill 0.2 pad 0.51 layers 1-3)
  Top_SIG1 0.152: QSE_J402.16 42.89,77.44 v42.76,77.41
  3_SIG2 0.102: v42.76,77.41 42.15,77.42 arc-39 41.78,77.6 41.58,77.8 arc45 41.15,77.98 36.96,77.98 arc45 36.74,77.89 35.72,76.89 arc47 35.62,76.66 35.61,73.95 arc-43 35.45,73.54 30.38,68.04 arc-47 29.93,67.84 29.74,67.84 arc49 29.28,67.63 JP1_EXT2_GPIOS.17
EXP2_SE_IO_11
  Top_SIG1 0.102: JP1_EXT2_GPIOS.18 26.34,66.73 27.2,67.65 arc-47 27.65,67.84 29.87,67.84 arc45 30.3,68.03 35.59,73.38 arc45 35.76,73.81 35.76,76.02 arc-90 37.37,77.62 37.69,77.62 37.9,77.41 QSE_J402.15
  Top_SIG1 0.152: 38.9,77.29 QSE_J402.15
FMC_SCL  (via drill 0.2 pad 0.51)
  Top_SIG1 0.102: QSE_J402.41 40.39,64.19 arc-41 40.79,64.34 65.1,64.34 65.33,64.11 arc-90 65.33,63.82 64.62,63.11 arc90 64.62,62.82 64.8,62.64 arc90 65.09,62.64 65.8,63.35 arc-90 66.09,63.35 66.4,63.04 arc-90 66.4,62.77 64.92,61.29 arc90 64.92,61.02 64.96,60.98 arc90 65.23,60.98 66.71,62.46 arc-90 66.98,62.46 67.02,62.42 arc-90 67.02,62.15 65.54,60.67 arc90 65.54,60.4 65.59,60.36 arc90 65.86,60.36 67.33,61.84 arc-90 67.6,61.84 67.65,61.79 arc-90 67.65,61.52 66.17,60.04 arc90 66.17,59.77 66.21,59.73 arc90 66.48,59.73 67.96,61.21 arc-90 68.23,61.21 68.27,61.17 arc-90 68.27,60.9 66.79,59.42 arc90 66.79,59.15 66.84,59.11 arc90 67.11,59.11 68.59,60.58 arc-90 68.85,60.58 68.9,60.54 arc-90 68.9,60.27 67.42,58.79 arc90 67.42,58.52 67.46,58.48 arc90 67.73,58.48 69.21,59.96 arc-90 69.48,59.96 69.52,59.91 arc-90 69.52,59.65 68.04,58.17 arc90 68.04,57.9 68.09,57.85 arc90 68.36,57.85 69.84,59.33 arc-90 70.11,59.33 74.79,56.06 arc35 74.88,56.03 arc45 74.88,56.03 86.88,55.96 arc33 87.05,56 v88.01,56.62
  Bottom_SIG4 0.152: v88.01,56.62 87.45,56.07 JA1:FMC1.C30
FMC_SDA  (via drill 0.2 pad 0.51)
  Top_SIG1 0.102: v86.67,56.64 86.37,57.04 arc8 86.34,57.07 86.29,57.16 arc68 86.15,57.25 74.93,57.35 arc-45 73.79,57.73 70.69,60.08 arc-90 70.69,60.35 71.81,61.48 arc90 71.81,61.75 71.77,61.8 arc90 71.5,61.8 70.38,60.66 arc-90 70.11,60.66 70.06,60.71 arc-90 70.06,60.98 71.18,62.11 arc90 71.18,62.38 71.14,62.43 arc90 70.87,62.42 69.75,61.29 arc-90 69.48,61.29 69.43,61.34 arc-90 69.43,61.61 70.55,62.74 arc90 70.55,63.01 70.5,63.05 arc90 70.24,63.05 69.11,61.92 arc-90 68.84,61.92 68.8,61.96 arc-90 68.8,62.23 69.92,63.36 arc90 69.92,63.63 69.87,63.68 arc90 69.6,63.68 68.48,62.55 arc-90 68.21,62.54 68.17,62.59 arc-90 68.16,62.86 69.29,63.99 arc90 69.29,64.26 69.24,64.3 arc90 68.97,64.3 67.85,63.17 arc-90 67.58,63.17 67.53,63.22 arc-90 67.53,63.48 68.66,64.62 arc90 68.66,64.89 68.61,64.93 arc90 68.34,64.93 67.22,63.8 arc-90 66.95,63.8 arc-90 66.95,64.08 67.17,64.31 arc90 67.16,64.59 66.73,65.03 arc90 66.44,65.03 66.22,64.81 arc-90 65.93,64.8 65.56,65.18 38.63,65.18 arc45 38.32,65.09 35.84,62.61 arc45 35.76,62.18 35.76,61.22 arc90 36.37,60.61 QSE_J402.47
  Bottom_SIG4 0.152: v86.67,56.64 v86.65,56.64 JA1:FMC1.C31
GBCTCLK1_N  (via drill 0.2 layers 1-5, 0.2 pad 0.51 layers 5-16)
  Top_SIG1 0.102: v156.48,59.8 154.63,59.8 arc-45 QSE_J401.50
  5_SIG3 0.102: v156.48,59.8 arc90 156.22,60.07 152.79,60.07 arc-45 152.58,60.16 150.62,62.12 arc45 150.41,62.2 146,62.2 arc90 145.8,62 145.8,61.8 arc-90 145.29,61.29 143.41,61.29 arc-90 142.9,61.8 142.9,62 arc90 142.7,62.2 138.06,62.2 arc45 137.84,62.12 133.52,57.79 arc-90 132.8,57.79 131.25,59.35 arc90 130.96,59.35 130.94,59.33 arc90 130.94,59.04 132.5,57.48 arc-90 132.5,56.77 132.47,56.75 arc-90 131.76,56.75 130.05,58.45 arc90 129.77,58.45 129.75,58.43 arc90 129.75,58.14 131.45,56.44 arc-90 131.45,55.72 126.63,50.9 arc-45 126.42,50.81 107.97,50.8 arc-90 107.57,51.22 107.58,54.36 arc90 107.28,54.66 100.61,54.66 arc-90 100,55.27 100,57.57 arc45 99.95,57.68 99.73,57.9 arc45 99.63,57.94 v99.47,57.94
  Bottom_SIG4 0.152: v99.47,57.94 99.47,57.92 JA1:FMC1.B21
GBCTCLK1_P  (via drill 0.2 layers 1-5, 0.2 pad 0.51 layers 5-16)
  Top_SIG1 0.102: QSE_J401.48 156.46,60.61 arc-45 v156.48,60.6
  5_SIG3 0.102: v100.84,57.94 100.67,57.94 arc45 100.56,57.89 100.35,57.68 arc45 100.31,57.57 100.31,55.27 arc90 100.61,54.97 107.3,54.99 arc-91 107.91,54.38 107.89,51.43 arc91 108.19,51.12 126.29,51.12 arc45 126.5,51.21 131.23,55.93 arc90 131.23,56.22 129.53,57.92 arc-90 129.53,58.64 129.55,58.66 arc-90 130.27,58.66 131.97,56.96 arc90 132.26,56.96 132.28,56.98 arc90 132.28,57.27 130.58,58.97 arc-90 130.58,59.69 130.6,59.71 arc-90 131.32,59.71 133.02,58.01 arc90 133.31,58.01 137.72,62.42 arc-45 137.93,62.51 142.7,62.51 arc-90 143.2,62 143.2,61.8 arc90 143.41,61.6 145.29,61.6 arc90 145.49,61.8 145.49,62 arc-90 146,62.51 150.53,62.51 arc-45 150.75,62.42 152.7,60.47 arc45 152.92,60.38 156.24,60.38 arc90 v156.48,60.6
  Bottom_SIG4 0.152: v100.84,57.94 | v100.84,57.94 JA1:FMC1.B20
GBTCLK0_N  (via drill 0.2 layers 1-3, 0.2 layers 3-16)
  Top_SIG1 0.102: QSE_J401.61 v147.2,55.01 arc-45 v147.19,55.01
  3_SIG2 0.102: v147.19,55.01 146.92,55.21 arc36 146.74,55.27 142.65,55.27 arc-90 142.14,55.78 142.14,57.3 arc90 141.94,57.5 141.82,57.5 arc90 141.62,57.3 141.62,55.78 arc-90 141.11,55.27 141,55.27 arc-90 140.49,55.78 140.49,57.36 arc90 140.29,57.56 140.18,57.56 arc90 139.98,57.36 139.98,55.78 arc-90 139.47,55.27 139.24,55.27 arc-90 138.75,55.77 138.75,58.68 arc90 138.56,58.87 138.55,58.87 arc90 138.36,58.68 138.36,55.77 arc-90 137.86,55.27 137.85,55.27 arc-90 137.36,55.77 137.36,58.68 arc90 137.16,58.87 137.15,58.87 arc90 136.96,58.68 136.96,55.77 arc-90 136.47,55.27 136.46,55.27 arc-90 135.96,55.77 135.96,58.68 arc90 135.77,58.87 135.76,58.87 arc90 135.57,58.68 135.57,55.77 arc-90 135.07,55.27 135.06,55.27 arc-90 134.57,55.77 134.57,58.68 arc90 134.38,58.87 134.37,58.87 arc90 134.18,58.68 134.18,55.77 arc-90 133.68,55.27 133.67,55.27 arc-90 133.18,55.77 133.18,58.68 arc90 132.99,58.87 132.97,58.87 arc90 132.78,58.68 132.78,55.77 arc-90 132.29,55.27 132.28,55.27 arc-90 131.78,55.77 131.78,58.68 arc90 131.59,58.87 131.58,58.87 arc90 131.39,58.68 131.39,55.77 arc-90 130.9,55.27 130.77,55.27 arc-45 130.56,55.36 130.49,55.42 arc-45 130.4,55.64 130.4,56.53 arc45 130.33,56.72 129.57,57.47 arc45 129.35,57.56 arc-90 128.84,58.06 128.84,58.68 arc90 128.64,58.88 127.56,58.88 arc90 127.36,58.68 127.36,58.06 arc-90 126.85,57.56 126.71,57.56 arc45 126.49,57.47 126.05,57.02 arc90 125.75,56.73 125.75,56.32 arc-45 125.67,56.11 125.46,55.91 arc45 125.37,55.69 125.37,54.97 arc-90 125.07,54.66 120.55,54.66 arc-90 120.24,54.97 120.24,55.07 arc67 120.06,55.35 v119.79,55.46
  Bottom_SIG4 0.102: v119.79,55.46 JA1:FMC1.D5
GBTCLK0_P  (via drill 0.2 layers 1-3, 0.2 layers 3-16)
  Top_SIG1 0.102: QSE_J401.59 v147.16,55.81 arc45 v147.15,55.81